# Altium project System Control.PrjPCB (part 2 of 3)

## Sheet System Control - FPGA Supply and Configuration.SchDoc
size C
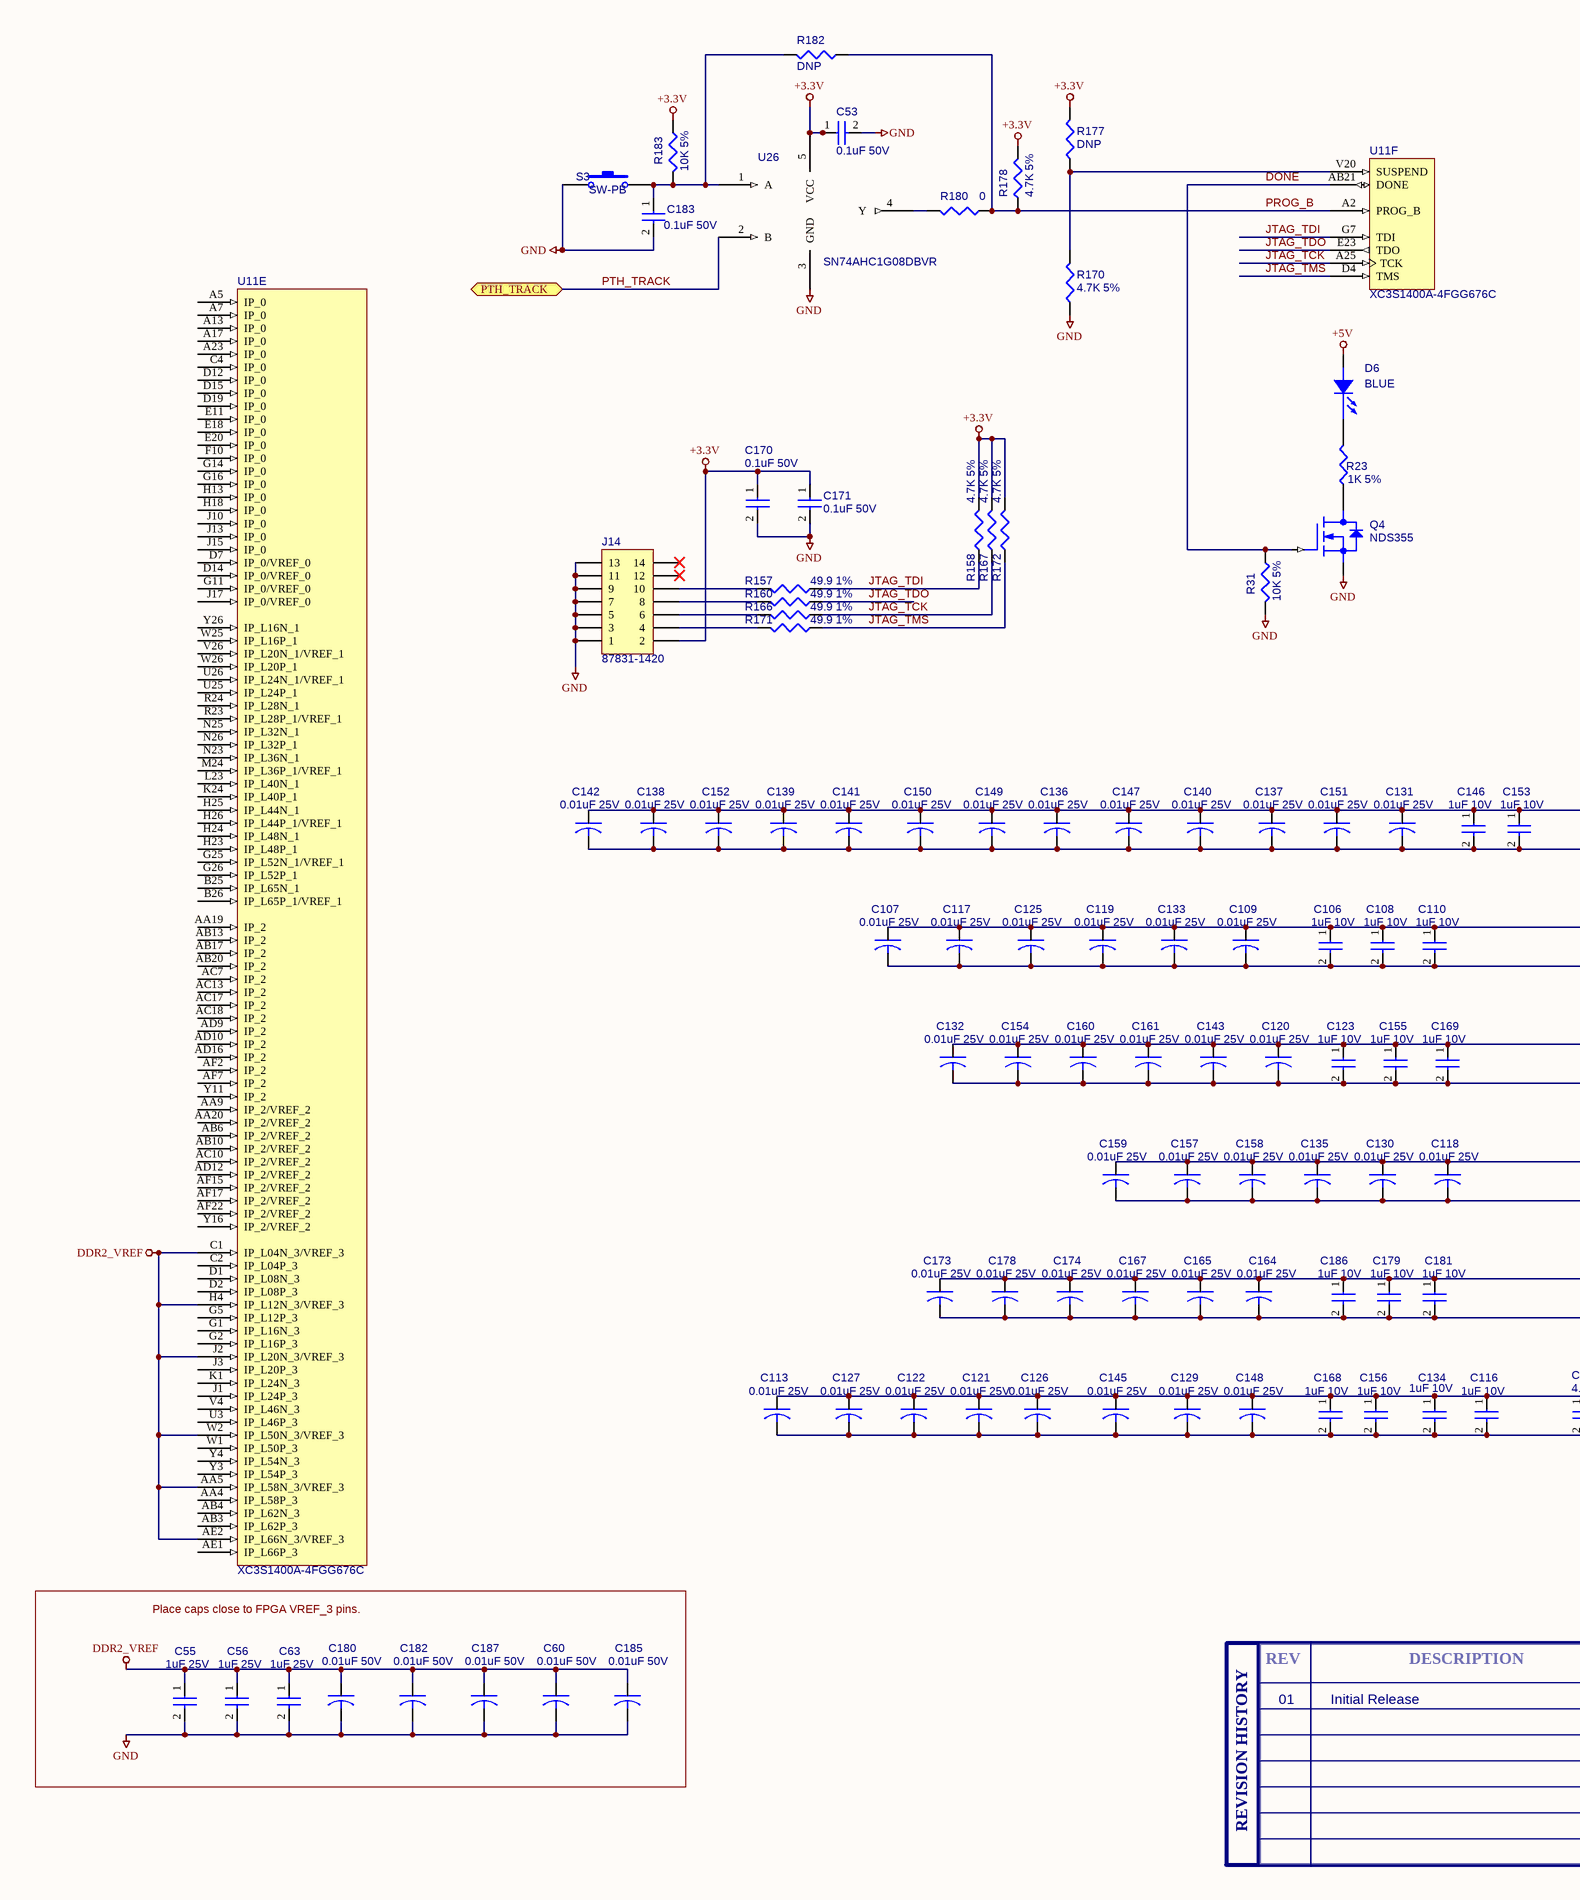
[diagram p4: System Control - FPGA Supply and Configuration.SchDoc, left]
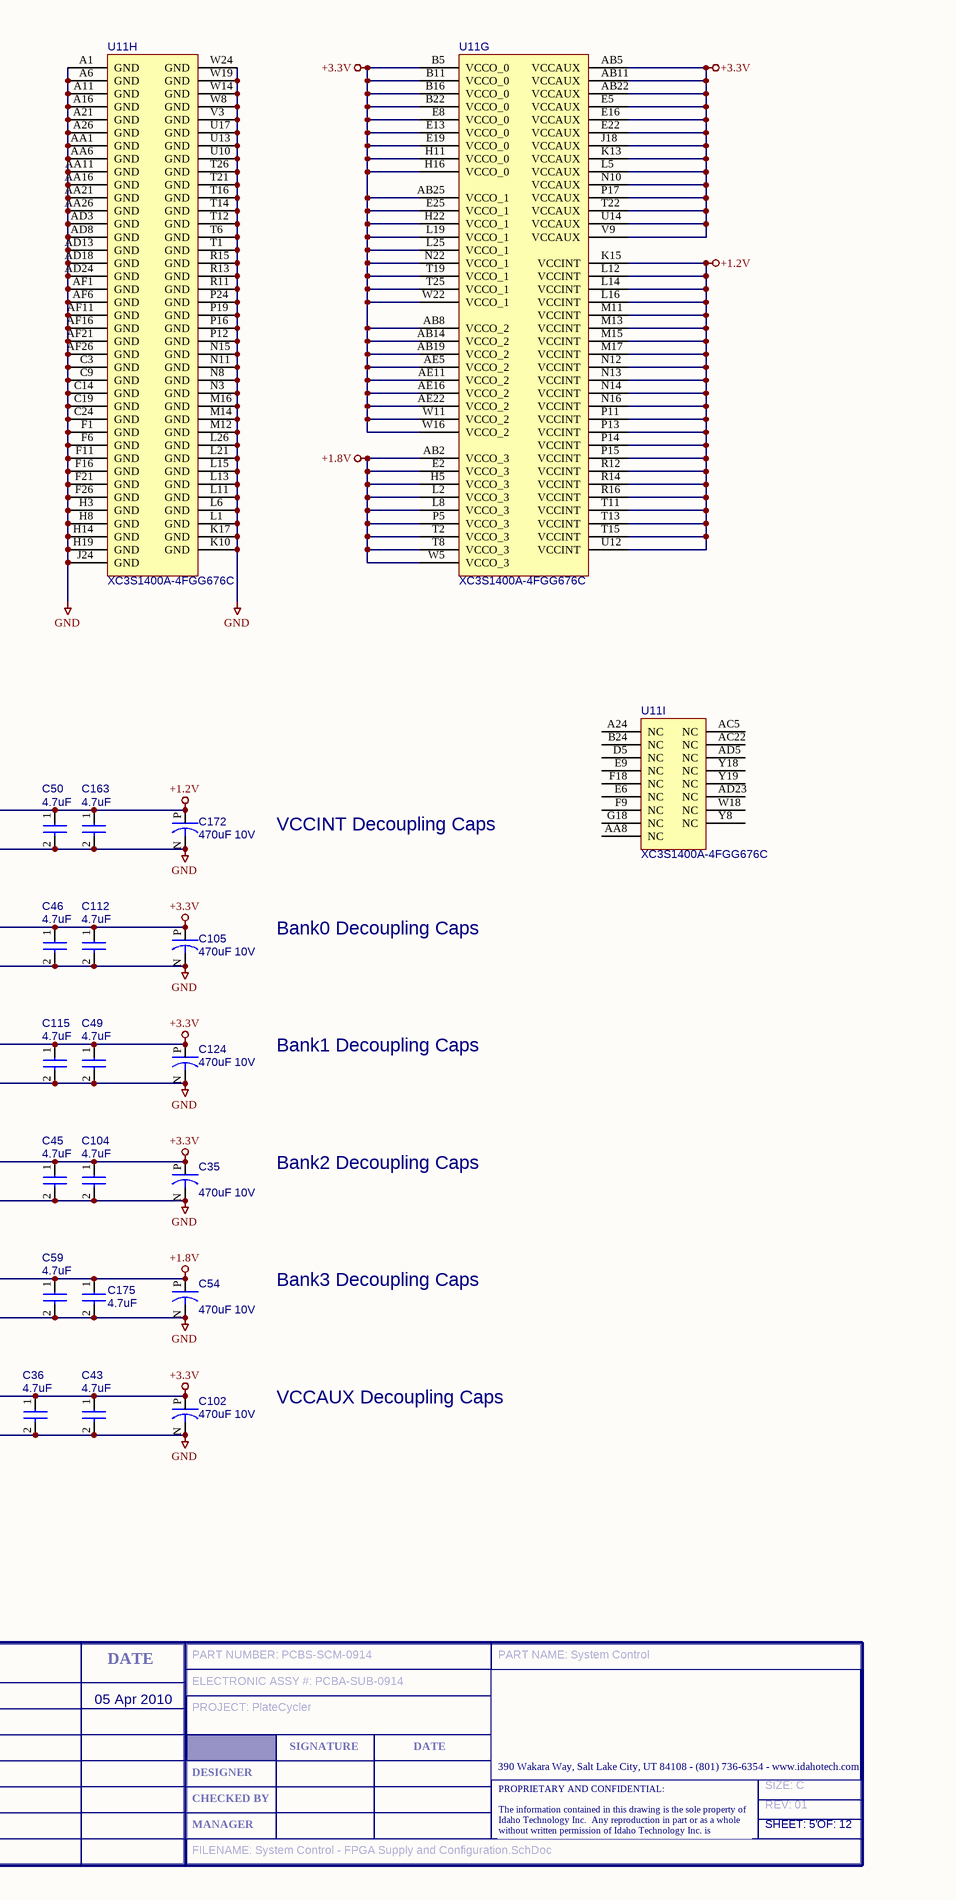
[diagram p5: System Control - FPGA Supply and Configuration.SchDoc, right]

### Parts
(Parts that share a designator on the sheet are numbered #1, #2 ... from top to bottom, then left to right.)
C35  470uF 10V  [SM/CT_7360]
C36  4.7uF  [SM/C_0603]
C43  4.7uF  [SM/C_0603]
C45  4.7uF  [SM/C_0603]
C46  4.7uF  [SM/C_0603]
C49  4.7uF  [SM/C_0603]
C50  4.7uF  [SM/C_0603]
C53  0.1uF 50V  [SM/C_0603]
C54  470uF 10V  [SM/CT_7360]
C55  1uF 25V  [SM/C_0603]
C56  1uF 25V  [SM/C_0603]
C59  4.7uF  [SM/C_0603]
C60  0.01uF 50V  [SM/C_0603]
C63  1uF 25V  [SM/C_0603]
C102  470uF 10V  [SM/CT_7360]
C104  4.7uF  [SM/C_0603]
C105  470uF 10V  [SM/CT_7360]
C106  1uF 10V  [SM/C_0603]
C107  0.01uF 25V  [SM/C_0402]
C108  1uF 10V  [SM/C_0603]
C109  0.01uF 25V  [SM/C_0402]
C110  1uF 10V  [SM/C_0603]
C112  4.7uF  [SM/C_0603]
C113  0.01uF 25V  [SM/C_0402]
C115  4.7uF  [SM/C_0603]
C116  1uF 10V  [SM/C_0603]
C117  0.01uF 25V  [SM/C_0402]
C118  0.01uF 25V  [SM/C_0402]
C119  0.01uF 25V  [SM/C_0402]
C120  0.01uF 25V  [SM/C_0402]
C121  0.01uF 25V  [SM/C_0402]
C122  0.01uF 25V  [SM/C_0402]
C123  1uF 10V  [SM/C_0603]
C124  470uF 10V  [SM/CT_7360]
C125  0.01uF 25V  [SM/C_0402]
C126  0.01uF 25V  [SM/C_0402]
C127  0.01uF 25V  [SM/C_0402]
C129  0.01uF 25V  [SM/C_0402]
C130  0.01uF 25V  [SM/C_0402]
C131  0.01uF 25V  [SM/C_0402]
C132  0.01uF 25V  [SM/C_0402]
C133  0.01uF 25V  [SM/C_0402]
C134  1uF 10V  [SM/C_0603]
C135  0.01uF 25V  [SM/C_0402]
C136  0.01uF 25V  [SM/C_0402]
C137  0.01uF 25V  [SM/C_0402]
C138  0.01uF 25V  [SM/C_0402]
C139  0.01uF 25V  [SM/C_0402]
C140  0.01uF 25V  [SM/C_0402]
C141  0.01uF 25V  [SM/C_0402]
C142  0.01uF 25V  [SM/C_0402]
C143  0.01uF 25V  [SM/C_0402]
C145  0.01uF 25V  [SM/C_0402]
C146  1uF 10V  [SM/C_0603]
C147  0.01uF 25V  [SM/C_0402]
C148  0.01uF 25V  [SM/C_0402]
C149  0.01uF 25V  [SM/C_0402]
C150  0.01uF 25V  [SM/C_0402]
C151  0.01uF 25V  [SM/C_0402]
C152  0.01uF 25V  [SM/C_0402]
C153  1uF 10V  [SM/C_0603]
C154  0.01uF 25V  [SM/C_0402]
C155  1uF 10V  [SM/C_0603]
C156  1uF 10V  [SM/C_0603]
C157  0.01uF 25V  [SM/C_0402]
C158  0.01uF 25V  [SM/C_0402]
C159  0.01uF 25V  [SM/C_0402]
C160  0.01uF 25V  [SM/C_0402]
C161  0.01uF 25V  [SM/C_0402]
C163  4.7uF  [SM/C_0603]
C164  0.01uF 25V  [SM/C_0402]
C165  0.01uF 25V  [SM/C_0402]
C167  0.01uF 25V  [SM/C_0402]
C168  1uF 10V  [SM/C_0603]
C169  1uF 10V  [SM/C_0603]
C170  0.1uF 50V  [SM/C_0603]
C171  0.1uF 50V  [SM/C_0603]
C172  470uF 10V  [SM/CT_7360]
C173  0.01uF 25V  [SM/C_0402]
C174  0.01uF 25V  [SM/C_0402]
C175  4.7uF  [SM/C_0603]
C178  0.01uF 25V  [SM/C_0402]
C179  1uF 10V  [SM/C_0603]
C180  0.01uF 50V  [SM/C_0603]
C181  1uF 10V  [SM/C_0603]
C182  0.01uF 50V  [SM/C_0603]
C183  0.1uF 50V  [SM/C_0603]
C185  0.01uF 50V  [SM/C_0603]
C186  1uF 10V  [SM/C_0603]
C187  0.01uF 50V  [SM/C_0603]
D6  BLUE  [LED 1206]
J14  Header 7X2  [87831-1420]  (value not drawn)
Q4  NDS355  [TO236AA/SOT23]
R23  1K 5%  [SM/R_0603]
R31  10K 5%  [SM/R_0603]
R157  49.9 1%  [SM/R_0603]
R158  4.7K 5%  [SM/R_0603]
R160  49.9 1%  [SM/R_0603]
R166  49.9 1%  [SM/R_0603]
R167  4.7K 5%  [SM/R_0603]
R170  4.7K 5%  [SM/R_0603]
R171  49.9 1%  [SM/R_0603]
R172  4.7K 5%  [SM/R_0603]
R177  DNP  [SM/R_0603]  (no BOM)
R178  4.7K 5%  [SM/R_0603]
R180  0  [SM/R_0603]
R182  DNP  [SM/R_0603]  (no BOM)
R183  10K 5%  [SM/R_0603]
S3  SW-PB  [PBSW SMD]
T?#5  SIZE: C  REV: 01  FILENAME: System Control - FPGA Supply and Configuration.SchDoc  PART NUMBER: PCBS-SCM-0914  PART NAME: System Control  ELECTRONIC ASSY #: PCBA-SUB-0914  PROJECT: PlateCycler  SHEET: 5'  OF: 12  (hidden comment: ITI Title Block, A Size)  (graphical)
U11  XC3S1400A-4FGG676C  [FGG676]  (parts E,F,G,H,I of 9)
U26  Manufacturer P/N: SN74AHC1G08DBVR  [SOT23-5]  (hidden comment: SN74AHC1G08)

### Blocks framed on the sheet
Place caps close to FPGA VREF_3 pins.: C55 C56 C60 C63 C180 C182 C185 C187

### Ports
PTH_TRACK

### Nets
+1.2V: C50.1 C131.1 C136.1 C137.1 C138.1 C139.1 C140.1 C141.1 C142.1 C146.1 C147.1 C149.1 C150.1 C151.1 C152.1 C153.1 C163.1 C172.P U11.K15(VCCINT) U11.L12(VCCINT) U11.L14(VCCINT) U11.L16(VCCINT) U11.M11(VCCINT) U11.M13(VCCINT) U11.M15(VCCINT) U11.M17(VCCINT) U11.N12(VCCINT) U11.N13(VCCINT) U11.N14(VCCINT) U11.N16(VCCINT) U11.P11(VCCINT) U11.P13(VCCINT) U11.P14(VCCINT) U11.P15(VCCINT) U11.R12(VCCINT) U11.R14(VCCINT) U11.R16(VCCINT) U11.T11(VCCINT) U11.T13(VCCINT) U11.T15(VCCINT) U11.U12(VCCINT)
+1.8V: C54.P C59.1 C164.1 C165.1 C167.1 C173.1 C174.1 C175.1 C178.1 C179.1 C181.1 C186.1 U11.AB2(VCCO_3) U11.E2(VCCO_3) U11.H5(VCCO_3) U11.L2(VCCO_3) U11.L8(VCCO_3) U11.P5(VCCO_3) U11.T2(VCCO_3) U11.T8(VCCO_3) U11.W5(VCCO_3)
+3.3V: C35.P C36.1 C43.1 C45.1 C46.1 C49.1 C53.1 C102.P C104.1 C105.P C106.1 C107.1 C108.1 C109.1 C110.1 C112.1 C113.1 C115.1 C116.1 C117.1 C118.1 C119.1 C120.1 C121.1 C122.1 C123.1 C124.P C125.1 C126.1 C127.1 C129.1 C130.1 C132.1 C133.1 C134.1 C135.1 C143.1 C145.1 C148.1 C154.1 C155.1 C156.1 C157.1 C158.1 C159.1 C160.1 C161.1 C168.1 C169.1 C170.1 C171.1 J14.2 R158.2 R167.2 R172.2 R177.2 R178.2 R183.1 U11.AB5(VCCAUX) U11.AB8(VCCO_2) U11.AB11(VCCAUX) U11.AB14(VCCO_2) U11.AB19(VCCO_2) U11.AB22(VCCAUX) U11.AB25(VCCO_1) U11.AE5(VCCO_2) U11.AE11(VCCO_2) U11.AE16(VCCO_2) U11.AE22(VCCO_2) U11.B5(VCCO_0) U11.B11(VCCO_0) U11.B16(VCCO_0) U11.B22(VCCO_0) U11.E5(VCCAUX) U11.E8(VCCO_0) U11.E13(VCCO_0) U11.E16(VCCAUX) U11.E19(VCCO_0) U11.E22(VCCAUX) U11.E25(VCCO_1) U11.H11(VCCO_0) U11.H16(VCCO_0) U11.H22(VCCO_1) U11.J18(VCCAUX) U11.K13(VCCAUX) U11.L5(VCCAUX) U11.L19(VCCO_1) U11.L25(VCCO_1) U11.N10(VCCAUX) U11.N22(VCCO_1) U11.P17(VCCAUX) U11.T19(VCCO_1) U11.T22(VCCAUX) U11.T25(VCCO_1) U11.U14(VCCAUX) U11.V9(VCCAUX) U11.W11(VCCO_2) U11.W16(VCCO_2) U11.W22(VCCO_1) U26.5(VCC)
+5V: D6.1(ANODE)
DDR2_VREF: C55.1 C56.1 C60.1 C63.1 C180.1 C182.1 C185.1 C187.1 U11.AA5(IP_L58N_3/VREF_3) U11.AE2(IP_L66N_3/VREF_3) U11.C1(IP_L04N_3/VREF_3) U11.H4(IP_L12N_3/VREF_3) U11.J2(IP_L20N_3/VREF_3) U11.W2(IP_L50N_3/VREF_3)
GND: C35.N C36.2 C43.2 C45.2 C46.2 C49.2 C50.2 C53.2 C54.N C55.2 C56.2 C59.2 C60.2 C63.2 C102.N C104.2 C105.N C106.2 C107.2 C108.2 C109.2 C110.2 C112.2 C113.2 C115.2 C116.2 C117.2 C118.2 C119.2 C120.2 C121.2 C122.2 C123.2 C124.N C125.2 C126.2 C127.2 C129.2 C130.2 C131.2 C132.2 C133.2 C134.2 C135.2 C136.2 C137.2 C138.2 C139.2 C140.2 C141.2 C142.2 C143.2 C145.2 C146.2 C147.2 C148.2 C149.2 C150.2 C151.2 C152.2 C153.2 C154.2 C155.2 C156.2 C157.2 C158.2 C159.2 C160.2 C161.2 C163.2 C164.2 C165.2 C167.2 C168.2 C169.2 C170.2 C171.2 C172.N C173.2 C174.2 C175.2 C178.2 C179.2 C180.2 C181.2 C182.2 C183.2 C185.2 C186.2 C187.2 J14.1 J14.3 J14.5 J14.7 J14.9 J14.11 J14.13 Q4.2(SOURCE) R31.2 R170.1 S3.1 U11.A1(GND) U11.A6(GND) U11.A11(GND) U11.A16(GND) U11.A21(GND) U11.A26(GND) U11.AA1(GND) U11.AA6(GND) U11.AA11(GND) U11.AA16(GND) U11.AA21(GND) U11.AA26(GND) U11.AD3(GND) U11.AD8(GND) U11.AD13(GND) U11.AD18(GND) U11.AD24(GND) U11.AF1(GND) U11.AF6(GND) U11.AF11(GND) U11.AF16(GND) U11.AF21(GND) U11.AF26(GND) U11.C3(GND) U11.C9(GND) U11.C14(GND) U11.C19(GND) U11.C24(GND) U11.F1(GND) U11.F6(GND) U11.F11(GND) U11.F16(GND) U11.F21(GND) U11.F26(GND) U11.H3(GND) U11.H8(GND) U11.H14(GND) U11.H19(GND) U11.J24(GND) U11.K10(GND) U11.K17(GND) U11.L1(GND) U11.L6(GND) U11.L11(GND) U11.L13(GND) U11.L15(GND) U11.L21(GND) U11.L26(GND) U11.M12(GND) U11.M14(GND) U11.M16(GND) U11.N3(GND) U11.N8(GND) U11.N11(GND) U11.N15(GND) U11.P12(GND) U11.P16(GND) U11.P19(GND) U11.P24(GND) U11.R11(GND) U11.R13(GND) U11.R15(GND) U11.T1(GND) U11.T6(GND) U11.T12(GND) U11.T14(GND) U11.T16(GND) U11.T21(GND) U11.T26(GND) U11.U10(GND) U11.U13(GND) U11.U17(GND) U11.V3(GND) U11.W8(GND) U11.W14(GND) U11.W19(GND) U11.W24(GND) U26.3(GND)
DONE: Q4.1(GATE) R31.1 U11.AB21(DONE)
JTAG_TCK: R166.1 R167.1 U11.A25(TCK)
JTAG_TDI: R157.1 R158.1 U11.G7(TDI)
JTAG_TDO: R160.1 U11.E23(TDO)
JTAG_TMS: R171.1 R172.1 U11.D4(TMS)
PROG_B: R178.1 R180.1 R182.1 U11.A2(PROG_B)
PTH_TRACK: U26.2(B) ; port PTH_TRACK
NetC183_1: C183.1 R182.2 R183.2 S3.2 U26.1(A)
NetD6_2: D6.2(CATHODE) R23.2
NetJ14_4: J14.4 R171.2
NetJ14_6: J14.6 R166.2
NetJ14_8: J14.8 R160.2
NetJ14_10: J14.10 R157.2
NetQ4_3: Q4.3(DRAIN) R23.1
NetR170_2: R170.2 R177.1 U11.V20(SUSPEND)
NetR180_2: R180.2 U26.4(Y)

Not connected (* = marked no-connect by the designer): J14 12* 14*; U11 A5(IP_0) A7(IP_0) A13(IP_0) A17(IP_0) A23(IP_0) A24(NC) AA4(IP_L58P_3) AA8(NC) AA9(IP_2/VREF_2) AA19(IP_2) AA20(IP_2/VREF_2) AB3(IP_L62P_3) AB4(IP_L62N_3) AB6(IP_2/VREF_2) AB10(IP_2/VREF_2) AB13(IP_2) AB17(IP_2) AB20(IP_2) AC5(NC) AC7(IP_2) AC10(IP_2/VREF_2) AC13(IP_2) AC17(IP_2) AC18(IP_2) AC22(NC) AD5(NC) AD9(IP_2) AD10(IP_2) AD12(IP_2/VREF_2) AD16(IP_2) AD23(NC) AE1(IP_L66P_3) AF2(IP_2) AF7(IP_2) AF15(IP_2/VREF_2) AF17(IP_2/VREF_2) AF22(IP_2/VREF_2) B24(NC) B25(IP_L65N_1) B26(IP_L65P_1/VREF_1) C2(IP_L04P_3) C4(IP_0) D1(IP_L08N_3) D2(IP_L08P_3) D5(NC) D7(IP_0/VREF_0) D12(IP_0) D14(IP_0/VREF_0) D15(IP_0) D19(IP_0) E6(NC) E9(NC) E11(IP_0) E18(IP_0) E20(IP_0) F9(NC) F10(IP_0) F18(NC) G1(IP_L16N_3) G2(IP_L16P_3) G5(IP_L12P_3) G11(IP_0/VREF_0) G14(IP_0) G16(IP_0) G18(NC) G25(IP_L52N_1/VREF_1) G26(IP_L52P_1) H13(IP_0) H18(IP_0) H23(IP_L48P_1) H24(IP_L48N_1) H25(IP_L44N_1) H26(IP_L44P_1/VREF_1) J1(IP_L24P_3) J3(IP_L20P_3) J10(IP_0) J13(IP_0) J15(IP_0) J17(IP_0/VREF_0) K1(IP_L24N_3) K24(IP_L40P_1) L23(IP_L40N_1) M24(IP_L36P_1/VREF_1) N23(IP_L36N_1) N25(IP_L32N_1) N26(IP_L32P_1) R23(IP_L28P_1/VREF_1) R24(IP_L28N_1) U3(IP_L46P_3) U25(IP_L24P_1) U26(IP_L24N_1/VREF_1) V4(IP_L46N_3) V26(IP_L20N_1/VREF_1) W1(IP_L50P_3) W18(NC) W25(IP_L16P_1) W26(IP_L20P_1) Y3(IP_L54P_3) Y4(IP_L54N_3) Y8(NC) Y11(IP_2) Y16(IP_2/VREF_2) Y18(NC) Y19(NC) Y26(IP_L16N_1)

### Notes on the sheet
- VCCINT Decoupling Caps
- Bank0 Decoupling Caps
- Bank1 Decoupling Caps
- Bank2 Decoupling Caps
- Bank3 Decoupling Caps
- VCCAUX Decoupling Caps
- 01
- Initial Release
- 05 Apr 2010
- (in symbol ITI A-size Title Block and Rev Table) REV; DESCRIPTION; DATE; SIGNATURE; 390 Wakara Way, Salt Lake City, UT 84108 - (801) 736-6354 - www.idahotech.com; DESIGNER; CHECKED BY; REVISION HISTORY; MANAGER; PROPRIETARY AND CONFIDENTIAL: / The information contained in this drawing is the sole property of / Idaho Technology Inc.  Any reproduction in part or as a whole / without written permission of Idaho Technology Inc. is prohibited.

### Library data of the parts
C35 C54 C102 C105 C124 C172 = CAP_1: CAP TANT LOESR 470UF 10V 10% SMD; Manufacturer: AVX Corporation; Manufacturer P/N: TPSV477K010R0060; Vendor: Digikey; Vendor P/N: 478-4162-1-ND
C36 C43 C45 C46 C49 C50 C59 C104 C112 C115 C163 C175 = CAP NP_1: CAP CER 4.7UF 10V Y5V 0603; Manufacturer P/N: GRM188F51A475ZE20D; Manufacturer: Murata; Vendor P/N: 490-3302-1-ND; Vendor: Digikey
C53 C170 C171 C183 = CAP NP_1: as C47 on sheet System Control - Bank0
C55 C56 C63 = CAP NP_1: CAP 1UF 25V CERAMIC 0603 X5S; Manufacturer P/N: ECJ-1V41E105M; Manufacturer: Panasonic; Vendor P/N: PCC2354CT-ND; Vendor: Digikey
C60 C180 C182 C185 C187 = C10nF 50V X7R 0603: CAP 10000PF 50V CERM X7R 0603; Manufacturer: Panasonic; Manufacturer P/N: ECJ-1VB1H103K; Vendor P/N: PCC1784CT-ND; Vendor: Digikey
C106 C108 C110 C116 C123 C134 C146 C153 C155 C156 C168 C169 C179 C181 C186 = CAP NP_1: CAP CER 1.0UF 10V X5R 10% 0402; Manufacturer P/N: 0402ZD105KAT2A; Manufacturer: AVX Corporation; Vendor P/N: 478-4596-1-ND; Vendor: Digikey
C107 C109 C113 C117-C122 C125-C127 C129-C133 C135-C143 C145 C147-C152 C154 C157-C161 C164 C165 C167 C173 C174 C178 = C10nF 50V X7R 0603: CAP .01UF 25V CERAMIC X7R 0402; Manufacturer: Panasonic; Manufacturer P/N: ECJ-0EB1E103K; Vendor P/N: PCC2270CT-ND; Vendor: Digikey
D6 = LED: LED INGAN/SIC U-BLUE CLR 1206SMD; Manufacturer: Lumex; Manufacturer P/N: SML-LX1206USBC-TR; Vendor: Digikey; Vendor P/N: 67-1701-1-ND
J14 = Header 7X2: CONN HEADER 14POS 2MM VERT GOLD; Manufacturer: Molex; Vendor P/N: WM17469-ND; Vendor: Digikey; LatestRevisionDate: 17-Jul-2002; LatestRevisionNote: Re-released for DXP Platform.; Publisher: Altium Limited; Manufacturer P/N: 87831-1420
Q4 = NDS355N/SOT: as Q5 on sheet System Control - Bank0; Manufacturer P/N: NDS355N
R23 = R1K 5% 0603: as R38 on sheet System Control - Bank0
R31 R183 = R10K 5% 0603: as R37 on sheet System Control - Bank0
R157 R160 R166 R171 = R1K 5% 0603: RES 49.9 OHM 1/10W 1% 0603 SMD; Manufacturer: Panasonic; Manufacturer P/N: ERJ-3EKF49R9V; Vendor: Digikey; Vendor P/N: P49.9HCT-ND
R158 R167 R170 R172 R177 R178 = R4.7K 5% 0603: RES 4.7K OHM 1/10W 5% 0603 SMD; Manufacturer P/N: ERJ-3GEYJ472V; Manufacturer: Panasonic; Vendor: Digikey; Vendor P/N: P4.7KGCT-ND
R180 R182 = R0 5% 0603: RES ZERO OHM 1/10W 5% 0603 SMD; Manufacturer: Panasonic; Manufacturer P/N: ERJ-3GEY0R00V; Vendor: Digikey; Vendor P/N: P0.0GCT-ND
S3 = SW-PB: SWITCH KEY 4MM SQ SMD GULL WING; Manufacturer: Bourns; Manufacturer P/N: 7914G-1-000E; Vendor P/N: 7914G-000ECT-ND; Vendor: Digikey
T?#5 = ITI A-size Title Block and Rev Table: ITI Title Block and Rev Table, A Size
U11 = XC3S1400A-4FGG676C: Spartan-3A  I/O Optimized FPGA, 502 User I/Os, 676-Pin Pb-Free FBGA, Standard Performance, Commercial Grade; Published: 12-Dec-2006; DatasheetVersion: 08-May-2007; PackageVersion: ver1.2.1, Apr-2005; PackageReference: FGG676; Publisher: Altium Limited; PackageDescription: 676-Ball Fine Pitch Ball Grid Array (FGG676) - Pb-Free; Code_JEDEC: MS-034-AAL-1; Code_IPC: BGA100P26X26-676; ComponentLink1Description: Manufacturer Link; ComponentLink1URL: http://www.xilinx.com/products/silicon_solutions/fpgas/spartan_series/spartan3a_fpgas/index.htm; ComponentLink2Description: Datasheet; ComponentLink2URL: http://direct.xilinx.com/bvdocs/publications/ds529.pdf
U26 = SN74AHC1G08: IC SGL 2IN POS-AND GATE SOT23-5; Manufacturer: Texas Instruments; Vendor P/N: 296-1091-1-ND; Vendor: Digikey; LatestRevisionDate: 17-Jul-2002; LatestRevisionNote: Re-released for DXP Platform.; Publisher: Altium Limited

## Sheet System Control - Mode DIP Switch.SchDoc
size B
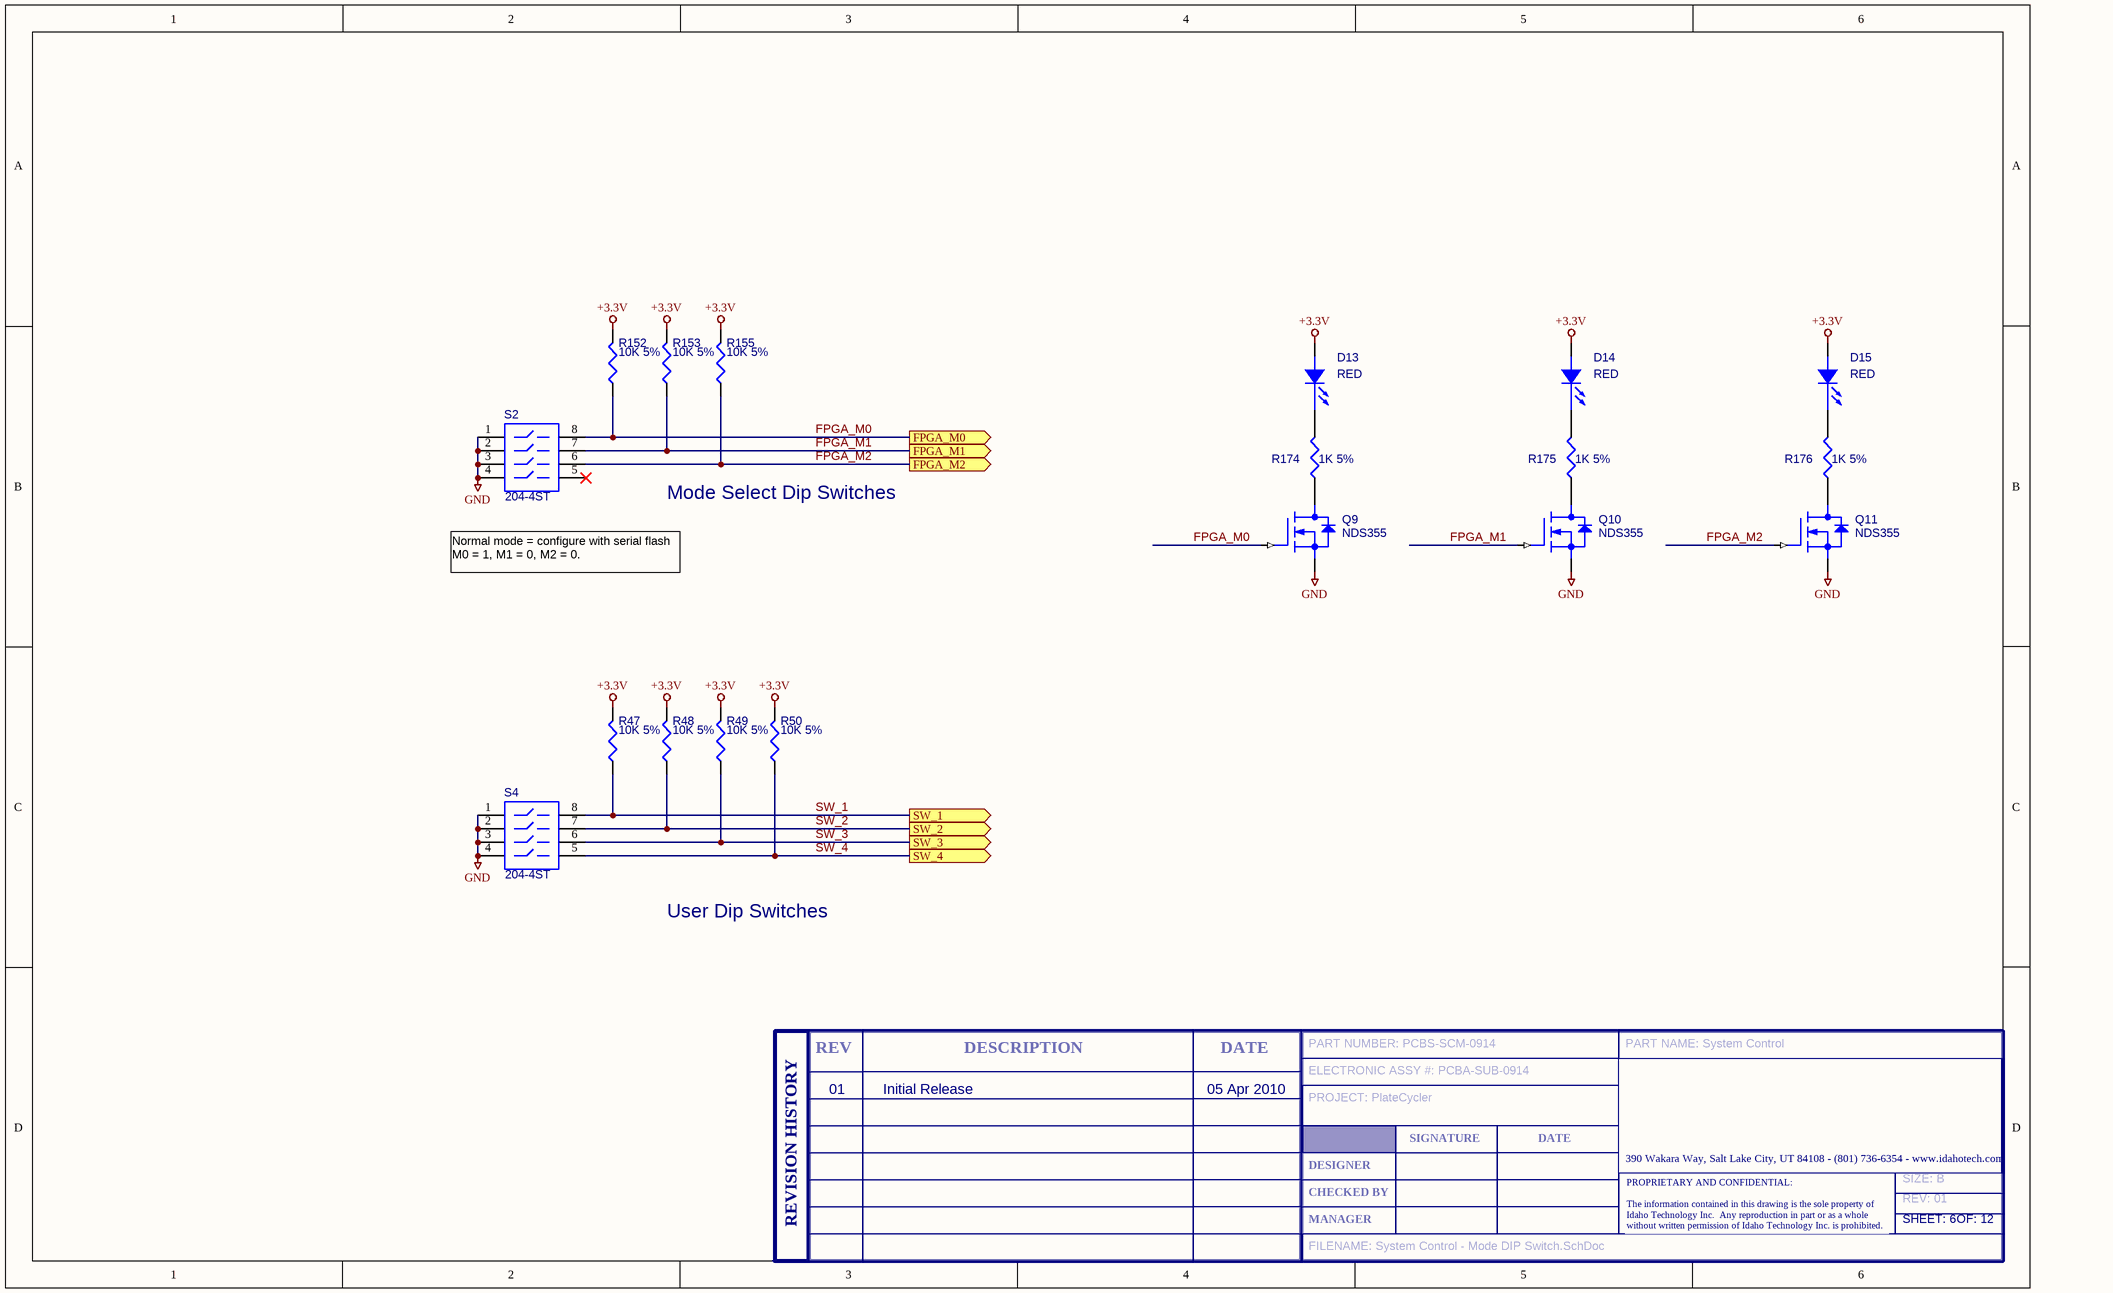
[diagram p6: System Control - Mode DIP Switch.SchDoc]

### Parts
(Parts that share a designator on the sheet are numbered #1, #2 ... from top to bottom, then left to right.)
D13  RED  [LED 1206]
D14  RED  [LED 1206]
D15  RED  [LED 1206]
Q9  NDS355  [TO236AA/SOT23]
Q10  NDS355  [TO236AA/SOT23]
Q11  NDS355  [TO236AA/SOT23]
R47  10K 5%  [SM/R_0603]
R48  10K 5%  [SM/R_0603]
R49  10K 5%  [SM/R_0603]
R50  10K 5%  [SM/R_0603]
R152  10K 5%  [SM/R_0603]
R153  10K 5%  [SM/R_0603]
R155  10K 5%  [SM/R_0603]
R174  1K 5%  [SM/R_0603]
R175  1K 5%  [SM/R_0603]
R176  1K 5%  [SM/R_0603]
S2  Manufacturer P/N: 204-4ST  [SPST_SMT8]  (hidden comment: SW-DIP4)
S4  Manufacturer P/N: 204-4ST  [SPST_SMT8]  (hidden comment: SW-DIP4)
T?#6  SIZE: B  REV: 01  FILENAME: System Control - Mode DIP Switch.SchDoc  PART NUMBER: PCBS-SCM-0914  PART NAME: System Control  ELECTRONIC ASSY #: PCBA-SUB-0914  PROJECT: PlateCycler  SHEET: 6  OF: 12  (hidden comment: ITI Title Block, A Size)  (graphical)

### Ports
FPGA_M0 (out), FPGA_M1 (out), FPGA_M2 (out), SW_1 (out), SW_2 (out), SW_3 (out), SW_4 (out)

### Nets
+3.3V: D13.1(ANODE) D14.1(ANODE) D15.1(ANODE) R47.2 R48.2 R49.2 R50.2 R152.2 R153.2 R155.2
GND: Q9.2(SOURCE) Q10.2(SOURCE) Q11.2(SOURCE) S2.1 S2.2 S2.3 S2.4 S4.1 S4.2 S4.3 S4.4
FPGA_M0: Q9.1(GATE) R152.1 S2.8 ; port FPGA_M0
FPGA_M1: Q10.1(GATE) R153.1 S2.7 ; port FPGA_M1
FPGA_M2: Q11.1(GATE) R155.1 S2.6 ; port FPGA_M2
SW_1: R47.1 S4.8 ; port SW_1
SW_2: R48.1 S4.7 ; port SW_2
SW_3: R49.1 S4.6 ; port SW_3
SW_4: R50.1 S4.5 ; port SW_4
NetD13_2: D13.2(CATHODE) R174.2
NetD14_2: D14.2(CATHODE) R175.2
NetD15_2: D15.2(CATHODE) R176.2
NetQ9_3: Q9.3(DRAIN) R174.1
NetQ10_3: Q10.3(DRAIN) R175.1
NetQ11_3: Q11.3(DRAIN) R176.1

Not connected (* = marked no-connect by the designer): S2 5*

### Notes on the sheet
- Mode Select Dip Switches
- Normal mode = configure with serial flash
  M0 = 1, M1 = 0, M2 = 0.
- User Dip Switches
- 01
- Initial Release
- 05 Apr 2010
- (in symbol ITI A-size Title Block and Rev Table) REV; DESCRIPTION; DATE; SIGNATURE; 390 Wakara Way, Salt Lake City, UT 84108 - (801) 736-6354 - www.idahotech.com; DESIGNER; CHECKED BY; REVISION HISTORY; MANAGER; PROPRIETARY AND CONFIDENTIAL: / The information contained in this drawing is the sole property of / Idaho Technology Inc.  Any reproduction in part or as a whole / without written permission of Idaho Technology Inc. is prohibited.

### Library data of the parts
D13-D15 = LED: as D9 on sheet System Control - Bank0
Q9-Q11 = NDS355N/SOT: as Q5 on sheet System Control - Bank0; Manufacturer P/N: NDS355N
R47-R50 R152 R153 R155 = R10K 5% 0603: as R37 on sheet System Control - Bank0
R174-R176 = R1K 5% 0603: as R38 on sheet System Control - Bank0
S2 S4 = SW-DIP4: SWITCH DIP 4POS TOP SLIDE SMT; Manufacturer: CTS Corporation Electro Components; Vendor: Digikey; Vendor P/N: CT2044ST-ND; Published: 24-Mar-1999; LatestRevisionDate: 17-Jul-2002; LatestRevisionNote: Re-released for DXP Platform.; PackageReference: DIP-8; Publisher: Altium Limited
T?#6 = ITI A-size Title Block and Rev Table: ITI Title Block and Rev Table, A Size

## Sheet System Control - Parallel Flash.SchDoc
size B
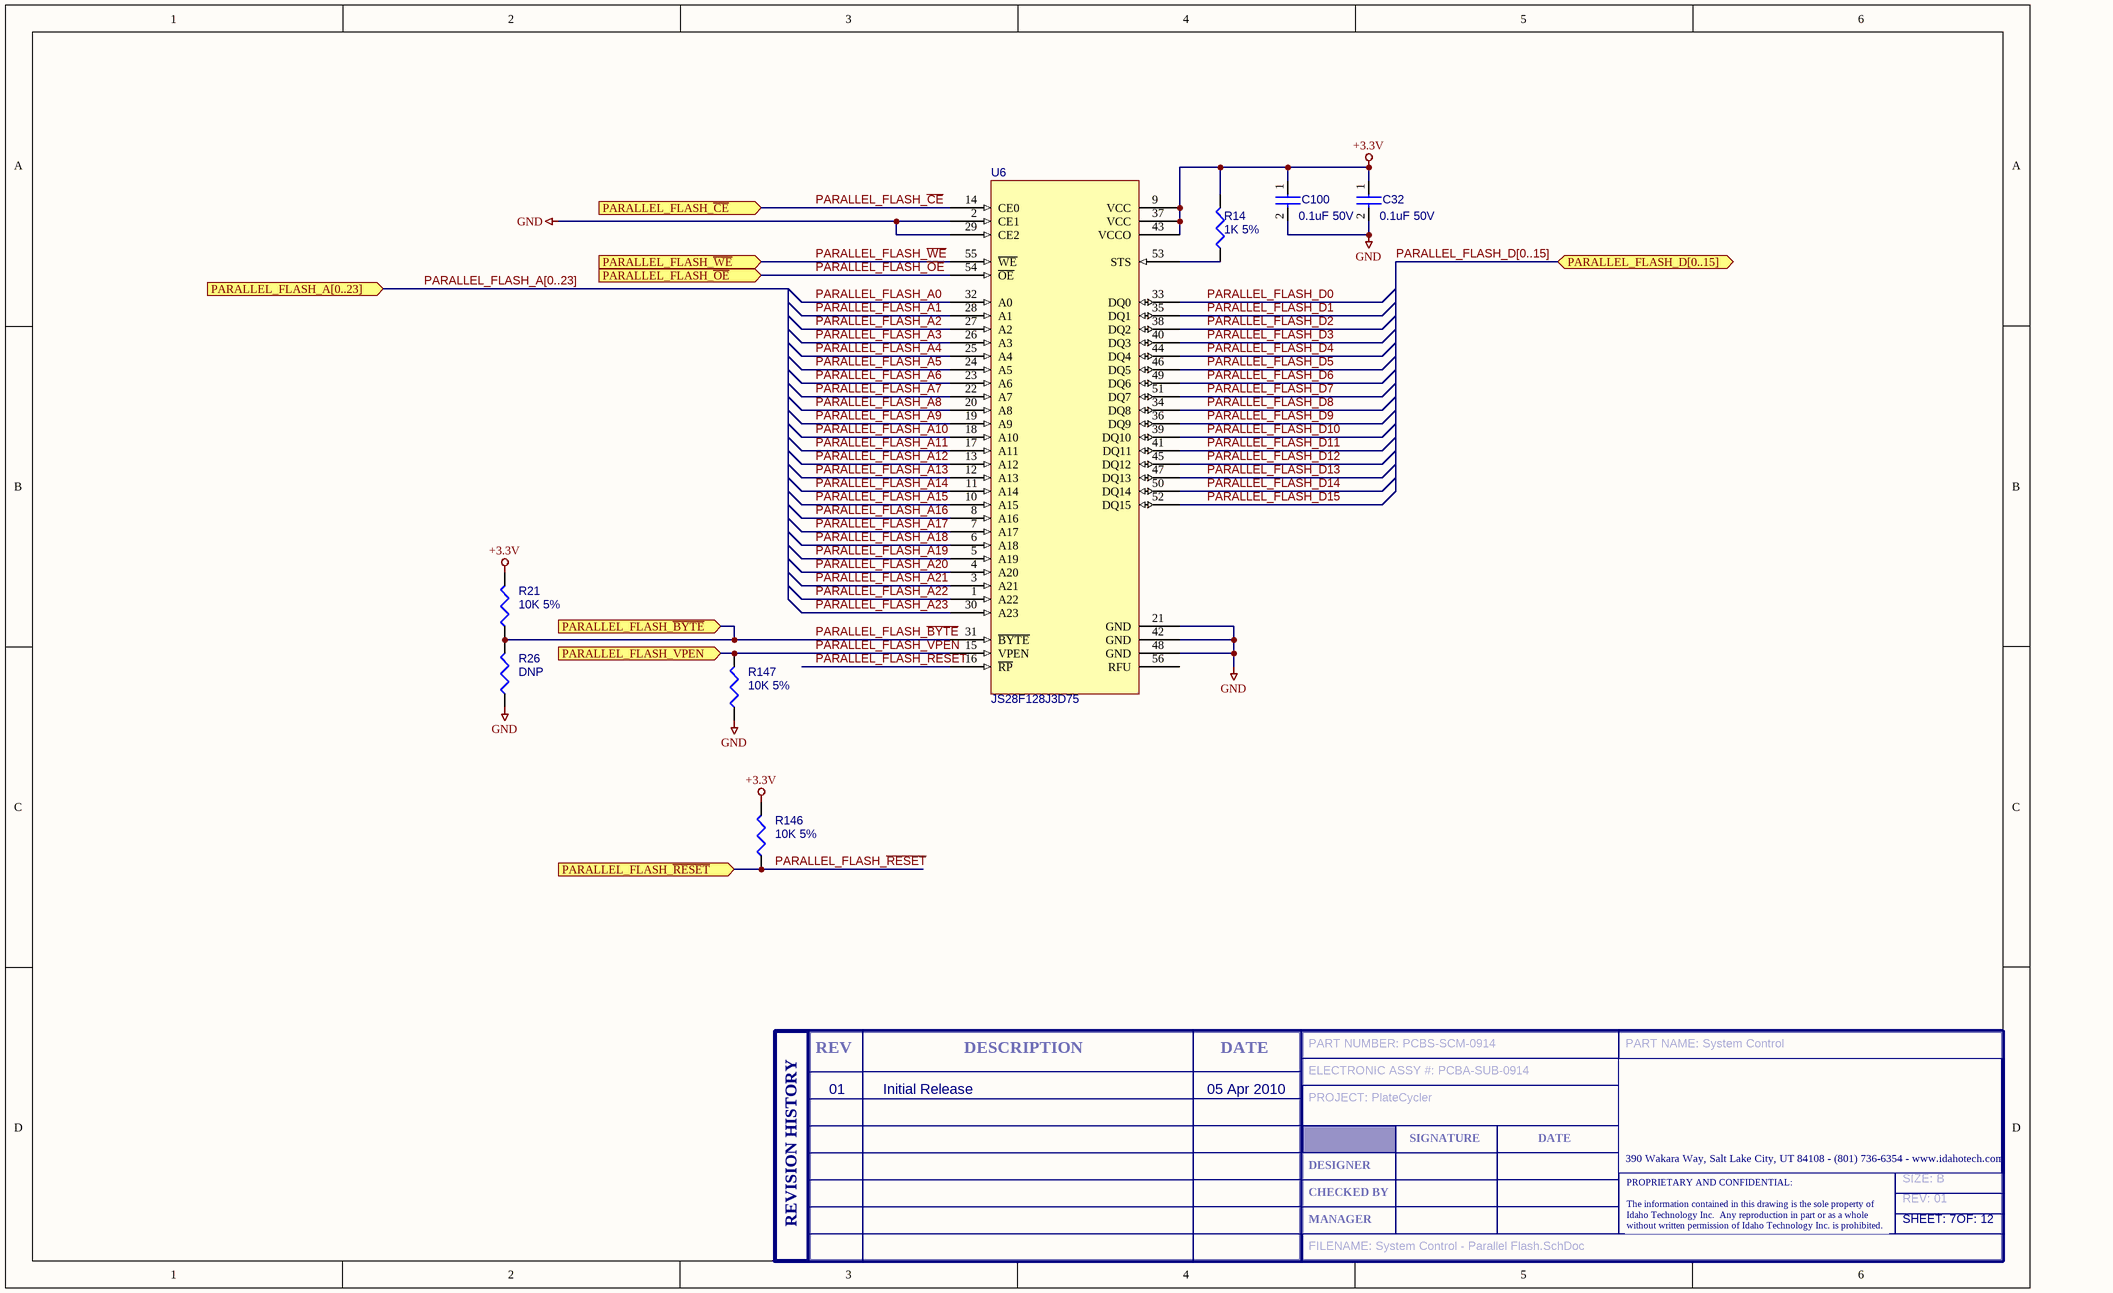
[diagram p7: System Control - Parallel Flash.SchDoc]

### Parts
(Parts that share a designator on the sheet are numbered #1, #2 ... from top to bottom, then left to right.)
C32  0.1uF 50V  [SM/C_0603]
C100  0.1uF 50V  [SM/C_0603]
R14  1K 5%  [SM/R_0603]
R21  10K 5%  [SM/R_0603]
R26  DNP  [SM/R_0603]  (no BOM)
R146  10K 5%  [SM/R_0603]
R147  10K 5%  [SM/R_0603]
T?#7  SIZE: B  REV: 01  FILENAME: System Control - Parallel Flash.SchDoc  PART NUMBER: PCBS-SCM-0914  PART NAME: System Control  ELECTRONIC ASSY #: PCBA-SUB-0914  PROJECT: PlateCycler  SHEET: 7  OF: 12  (hidden comment: ITI Title Block, A Size)  (graphical)
U6  JS28F128J3D75  [TSOP56]  (no BOM)

### Ports
PARALLEL_FLASH_A[0..23] (in), PARALLEL_FLASH_D[0..15] (bidir), PARALLEL_FLASH_VPEN (in), PARALLEL_FLASH_~{BYTE} (in), PARALLEL_FLASH_~{CE} (in), PARALLEL_FLASH_~{OE} (in), PARALLEL_FLASH_~{RESET} (in), PARALLEL_FLASH_~{WE} (in)

### Nets
+3.3V: C32.1 C100.1 R14.2 R21.2 R146.2 U6.9(VCC) U6.37(VCC) U6.43(VCCO)
GND: C32.2 C100.2 R26.1 R147.1 U6.2(CE1) U6.21(GND) U6.29(CE2) U6.42(GND) U6.48(GND)
PARALLEL_FLASH_A0: U6.32(A0)
PARALLEL_FLASH_A1: U6.28(A1)
PARALLEL_FLASH_A2: U6.27(A2)
PARALLEL_FLASH_A3: U6.26(A3)
PARALLEL_FLASH_A4: U6.25(A4)
PARALLEL_FLASH_A5: U6.24(A5)
PARALLEL_FLASH_A6: U6.23(A6)
PARALLEL_FLASH_A7: U6.22(A7)
PARALLEL_FLASH_A8: U6.20(A8)
PARALLEL_FLASH_A9: U6.19(A9)
PARALLEL_FLASH_A10: U6.18(A10)
PARALLEL_FLASH_A11: U6.17(A11)
PARALLEL_FLASH_A12: U6.13(A12)
PARALLEL_FLASH_A13: U6.12(A13)
PARALLEL_FLASH_A14: U6.11(A14)
PARALLEL_FLASH_A15: U6.10(A15)
PARALLEL_FLASH_A16: U6.8(A16)
PARALLEL_FLASH_A17: U6.7(A17)
PARALLEL_FLASH_A18: U6.6(A18)
PARALLEL_FLASH_A19: U6.5(A19)
PARALLEL_FLASH_A20: U6.4(A20)
PARALLEL_FLASH_A21: U6.3(A21)
PARALLEL_FLASH_A22: U6.1(A22)
PARALLEL_FLASH_A23: U6.30(A23)
PARALLEL_FLASH_~{BYTE}: R21.1 R26.2 U6.31(~{BYTE}) ; port PARALLEL_FLASH_~{BYTE}
PARALLEL_FLASH_~{CE}: U6.14(CE0) ; port PARALLEL_FLASH_~{CE}
PARALLEL_FLASH_D0: U6.33(DQ0)
PARALLEL_FLASH_D1: U6.35(DQ1)
PARALLEL_FLASH_D2: U6.38(DQ2)
PARALLEL_FLASH_D3: U6.40(DQ3)
PARALLEL_FLASH_D4: U6.44(DQ4)
PARALLEL_FLASH_D5: U6.46(DQ5)
PARALLEL_FLASH_D6: U6.49(DQ6)
PARALLEL_FLASH_D7: U6.51(DQ7)
PARALLEL_FLASH_D8: U6.34(DQ8)
PARALLEL_FLASH_D9: U6.36(DQ9)
PARALLEL_FLASH_D10: U6.39(DQ10)
PARALLEL_FLASH_D11: U6.41(DQ11)
PARALLEL_FLASH_D12: U6.45(DQ12)
PARALLEL_FLASH_D13: U6.47(DQ13)
PARALLEL_FLASH_D14: U6.50(DQ14)
PARALLEL_FLASH_D15: U6.52(DQ15)
PARALLEL_FLASH_~{OE}: U6.54(~{OE}) ; port PARALLEL_FLASH_~{OE}
PARALLEL_FLASH_~{RESET}: R146.1 U6.16(~{RP}) ; port PARALLEL_FLASH_~{RESET}
PARALLEL_FLASH_VPEN: R147.2 U6.15(VPEN) ; port PARALLEL_FLASH_VPEN
PARALLEL_FLASH_~{WE}: U6.55(~{WE}) ; port PARALLEL_FLASH_~{WE}
NetR14_1: R14.1 U6.53(STS)

Not connected (* = marked no-connect by the designer): U6 56(RFU)

### Buses and harness runs
bus PARALLEL_FLASH_A[0..23] = port PARALLEL_FLASH_A[0..23]
bus PARALLEL_FLASH_D[0..15] = port PARALLEL_FLASH_D[0..15]

### Notes on the sheet
- 01
- Initial Release
- 05 Apr 2010
- (in symbol ITI A-size Title Block and Rev Table) REV; DESCRIPTION; DATE; SIGNATURE; 390 Wakara Way, Salt Lake City, UT 84108 - (801) 736-6354 - www.idahotech.com; DESIGNER; CHECKED BY; REVISION HISTORY; MANAGER; PROPRIETARY AND CONFIDENTIAL: / The information contained in this drawing is the sole property of / Idaho Technology Inc.  Any reproduction in part or as a whole / without written permission of Idaho Technology Inc. is prohibited.

### Library data of the parts
C32 C100 = CAP NP_1: CAP CER .10UF 50V X7R 0603; Manufacturer P/N: UMK107B7104KA-T; Manufacturer: Taiyo Yuden; Vendor P/N: 587-1243-1-ND; Vendor: Digikey
R14 = R1K 5% 0603: RES 1.0K OHM 1/10W 5% 0603 SMD; Manufacturer: Panasonic; Manufacturer P/N: ERJ-3GEYJ102V; Vendor: Digikey; Vendor P/N: P1.0KGCT-ND
R21 R26 R146 R147 = R10K 5% 0603: RES 10K OHM 1/10W 5% 0603 SMD; Manufacturer: Panasonic; Manufacturer P/N: ERJ-3GEYJ103V; Vendor: Digikey; Vendor P/N: P10KGCT-ND
T?#7 = ITI A-size Title Block and Rev Table: ITI Title Block and Rev Table, A Size
U6 = JS28F128J3D75: Flash Mem Parallel 2.7V to 3.6V 128M-Bit 16M x 8/8M x 16 75ns 56-Pin TSOP; Manufacturer: Numonyx; Vendor: Avnet; Manufacturer P/N: JS28F128J3D75; Vendor P/N: JS28F128J3D75

## Sheet System Control - Power Supervisors.SchDoc
size B
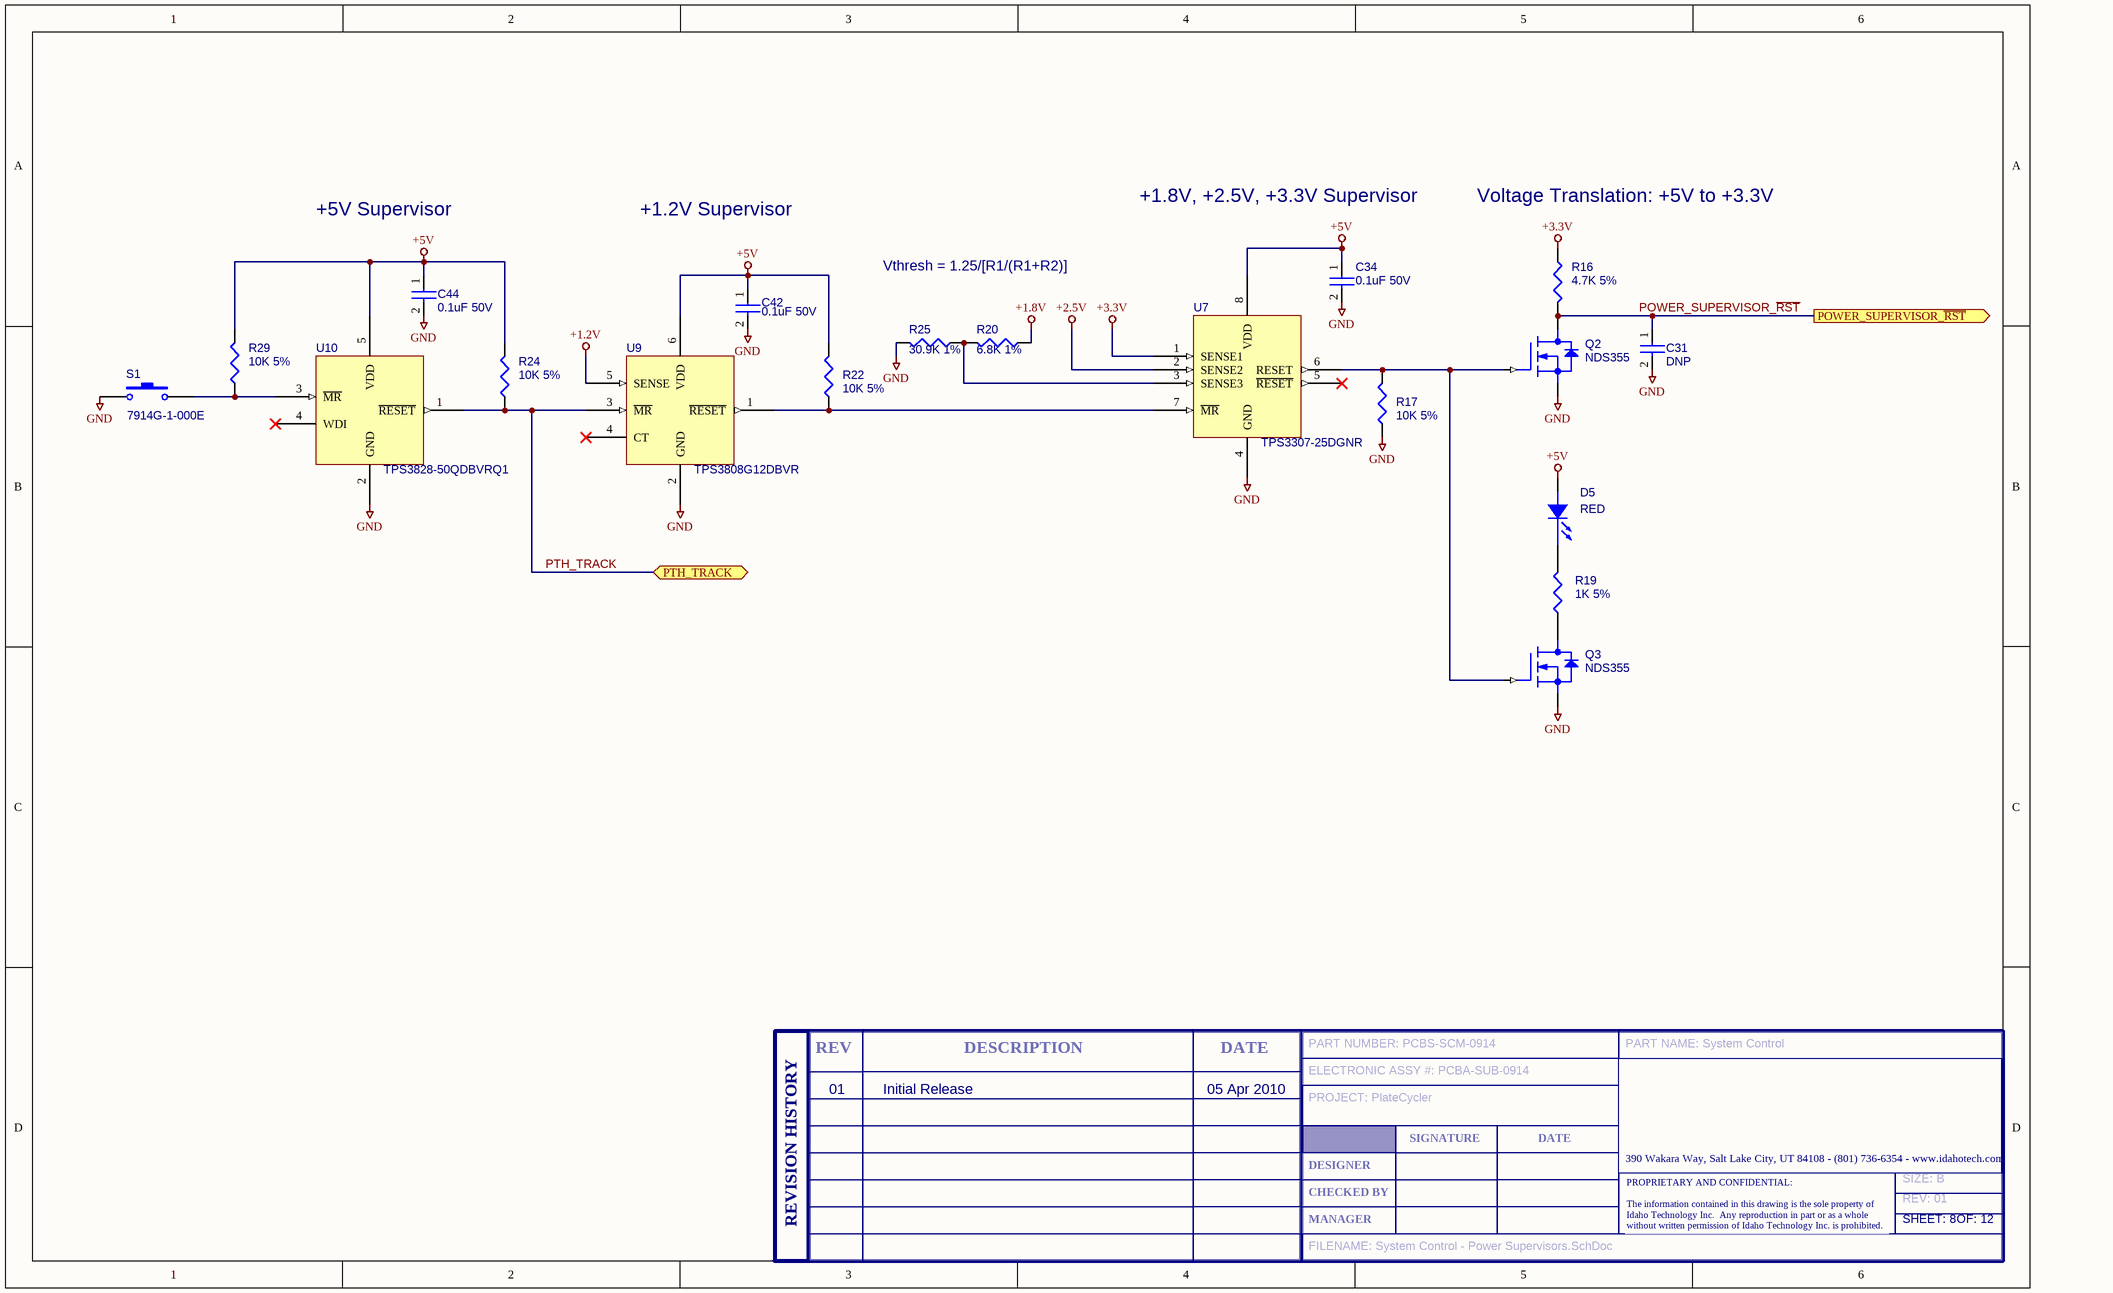
[diagram p8: System Control - Power Supervisors.SchDoc]

### Parts
(Parts that share a designator on the sheet are numbered #1, #2 ... from top to bottom, then left to right.)
C31  DNP  [SM/C_0603]  (no BOM)
C34  0.1uF 50V  [SM/C_0603]
C42  0.1uF 50V  [SM/C_0603]
C44  0.1uF 50V  [SM/C_0603]
D5  RED  [LED 1206]
Q2  NDS355  [TO236AA/SOT23]
Q3  NDS355  [TO236AA/SOT23]
R16  4.7K 5%  [SM/R_0603]
R17  10K 5%  [SM/R_0603]
R19  1K 5%  [SM/R_0603]
R20  6.8K 1%  [SM/R_0603]
R22  10K 5%  [SM/R_0603]
R24  10K 5%  [SM/R_0603]
R25  30.9K 1%  [SM/R_0603]
R29  10K 5%  [SM/R_0603]
S1  Manufacturer P/N: 7914G-1-000E  [PBSW SMD]  (hidden comment: SW-PB)
T?#8  SIZE: B  REV: 01  FILENAME: System Control - Power Supervisors.SchDoc  PART NUMBER: PCBS-SCM-0914  PART NAME: System Control  ELECTRONIC ASSY #: PCBA-SUB-0914  PROJECT: PlateCycler  SHEET: 8  OF: 12  (hidden comment: ITI Title Block, A Size)  (graphical)
U7  TPS3307-25DGNR  [MSOP8 PowerPAD]
U9  TPS3808G12DBVR  [SOT23-6]
U10  TPS3828-50QDBVRQ1  [SOT23-5]

### Ports
POWER_SUPERVISOR_~{RST} (out), PTH_TRACK

### Nets
+1.2V: U9.5(SENSE)
+1.8V: R20.1
+2.5V: U7.2(SENSE2)
+3.3V: R16.1 U7.1(SENSE1)
+5V: C34.1 C42.1 C44.1 D5.1(ANODE) R22.2 R24.2 R29.2 U7.8(VDD) U9.6(VDD) U10.5(VDD)
GND: C31.2 C34.2 C42.2 C44.2 Q2.2(SOURCE) Q3.2(SOURCE) R17.1 R25.2 S1.1 U7.4(GND) U9.2(GND) U10.2(GND)
POWER_SUPERVISOR_~{RST}: C31.1 Q2.3(DRAIN) R16.2 ; port POWER_SUPERVISOR_~{RST}
PTH_TRACK: R24.1 U9.3(~{MR}) U10.1(~{RESET}) ; port PTH_TRACK
NetD5_2: D5.2(CATHODE) R19.2
NetQ2_1: Q2.1(GATE) Q3.1(GATE) R17.2 U7.6(RESET)
NetQ3_3: Q3.3(DRAIN) R19.1
NetR20_2: R20.2 R25.1 U7.3(SENSE3)
NetR22_1: R22.1 U7.7(~{MR}) U9.1(~{RESET})
NetR29_1: R29.1 S1.2 U10.3(~{MR})

Not connected (* = marked no-connect by the designer): U7 5(~{RESET})*; U9 4(CT)*; U10 4(WDI)*

### Notes on the sheet
- +5V Supervisor
- +1.2V Supervisor
- +1.8V, +2.5V, +3.3V Supervisor
- Voltage Translation: +5V to +3.3V
- Vthresh = 1.25/[R1/(R1+R2)]
- 01
- Initial Release
- 05 Apr 2010
- (in symbol ITI A-size Title Block and Rev Table) REV; DESCRIPTION; DATE; SIGNATURE; 390 Wakara Way, Salt Lake City, UT 84108 - (801) 736-6354 - www.idahotech.com; DESIGNER; CHECKED BY; REVISION HISTORY; MANAGER; PROPRIETARY AND CONFIDENTIAL: / The information contained in this drawing is the sole property of / Idaho Technology Inc.  Any reproduction in part or as a whole / without written permission of Idaho Technology Inc. is prohibited.

### Library data of the parts
C31 C34 C42 C44 = CAP NP_1: as C32 on sheet System Control - Parallel Flash
D5 = LED: LED 635NM RED WTR CLR 1206 SMD; Manufacturer: Lumex; Manufacturer P/N: SML-LX1206IC-TR; Vendor: Digikey; Vendor P/N: 67-1356-1-ND
Q2 Q3 = NDS355N/SOT: MOSFET N-CH 30V 1.6A SOT-23; Manufacturer: Fairchild Semiconductor; Vendor: Digikey; Vendor P/N: NDS355NCT-ND; Manufacturer P/N: NDS355N
R16 = R4.7K 5% 0603: RES 4.7K OHM 1/10W 5% 0603 SMD; Manufacturer P/N: ERJ-3GEYJ472V; Manufacturer: Panasonic; Vendor: Digikey; Vendor P/N: P4.7KGCT-ND
R17 R22 R24 R29 = R10K 5% 0603: as R21 on sheet System Control - Parallel Flash
R19 = R1K 5% 0603: as R14 on sheet System Control - Parallel Flash
R20 = R1K 5% 0603: RES 6.80K OHM 1/10W 1% 0603 SMD; Manufacturer: Panasonic; Manufacturer P/N: ERJ-3EKF6801V; Vendor: Digikey; Vendor P/N: P6.80KHCT-ND
R25 = R1K 5% 0603: RES 30.9K OHM 1/10W 1% 0603 SMD; Manufacturer: Panasonic; Manufacturer P/N: ERJ-3EKF3092V; Vendor: Digikey; Vendor P/N: P30.9KHCT-ND
S1 = SW-PB: SWITCH KEY 4MM SQ SMD GULL WING; Manufacturer: Bourns; Vendor P/N: 7914G-000ECT-ND; Vendor: Digikey
T?#8 = ITI A-size Title Block and Rev Table: ITI Title Block and Rev Table, A Size
U7 = TPS3307-25DGNR: IC 3.3/2.5V/ADJ TPL MONIT 8-MSOP; Manufacturer: Texas Instruments; Vendor P/N: 296-3313-1-ND; Vendor: Digikey; Manufacturer P/N: TPS3307-25DGNR
U9 = TPS3808G12DBVR: IC VOLT SUPERVISOR 1.2V SOT23-6; Manufacturer: Texas Instruments; Vendor P/N: 296-17190-1-ND; Vendor: Digikey; Manufacturer P/N: TPS3808G12DBVR
U10 = TPS3828-50QDBVRQ1: IC 4.55V SUPPLY MONITOR SOT23-5; Manufacturer: Texas Instrument; Vendor P/N: 296-15659-1-ND; Vendor: Digikey; Manufacturer P/N: TPS3828-50QDBVRQ1

## Sheet System Control - Power.SchDoc
size C
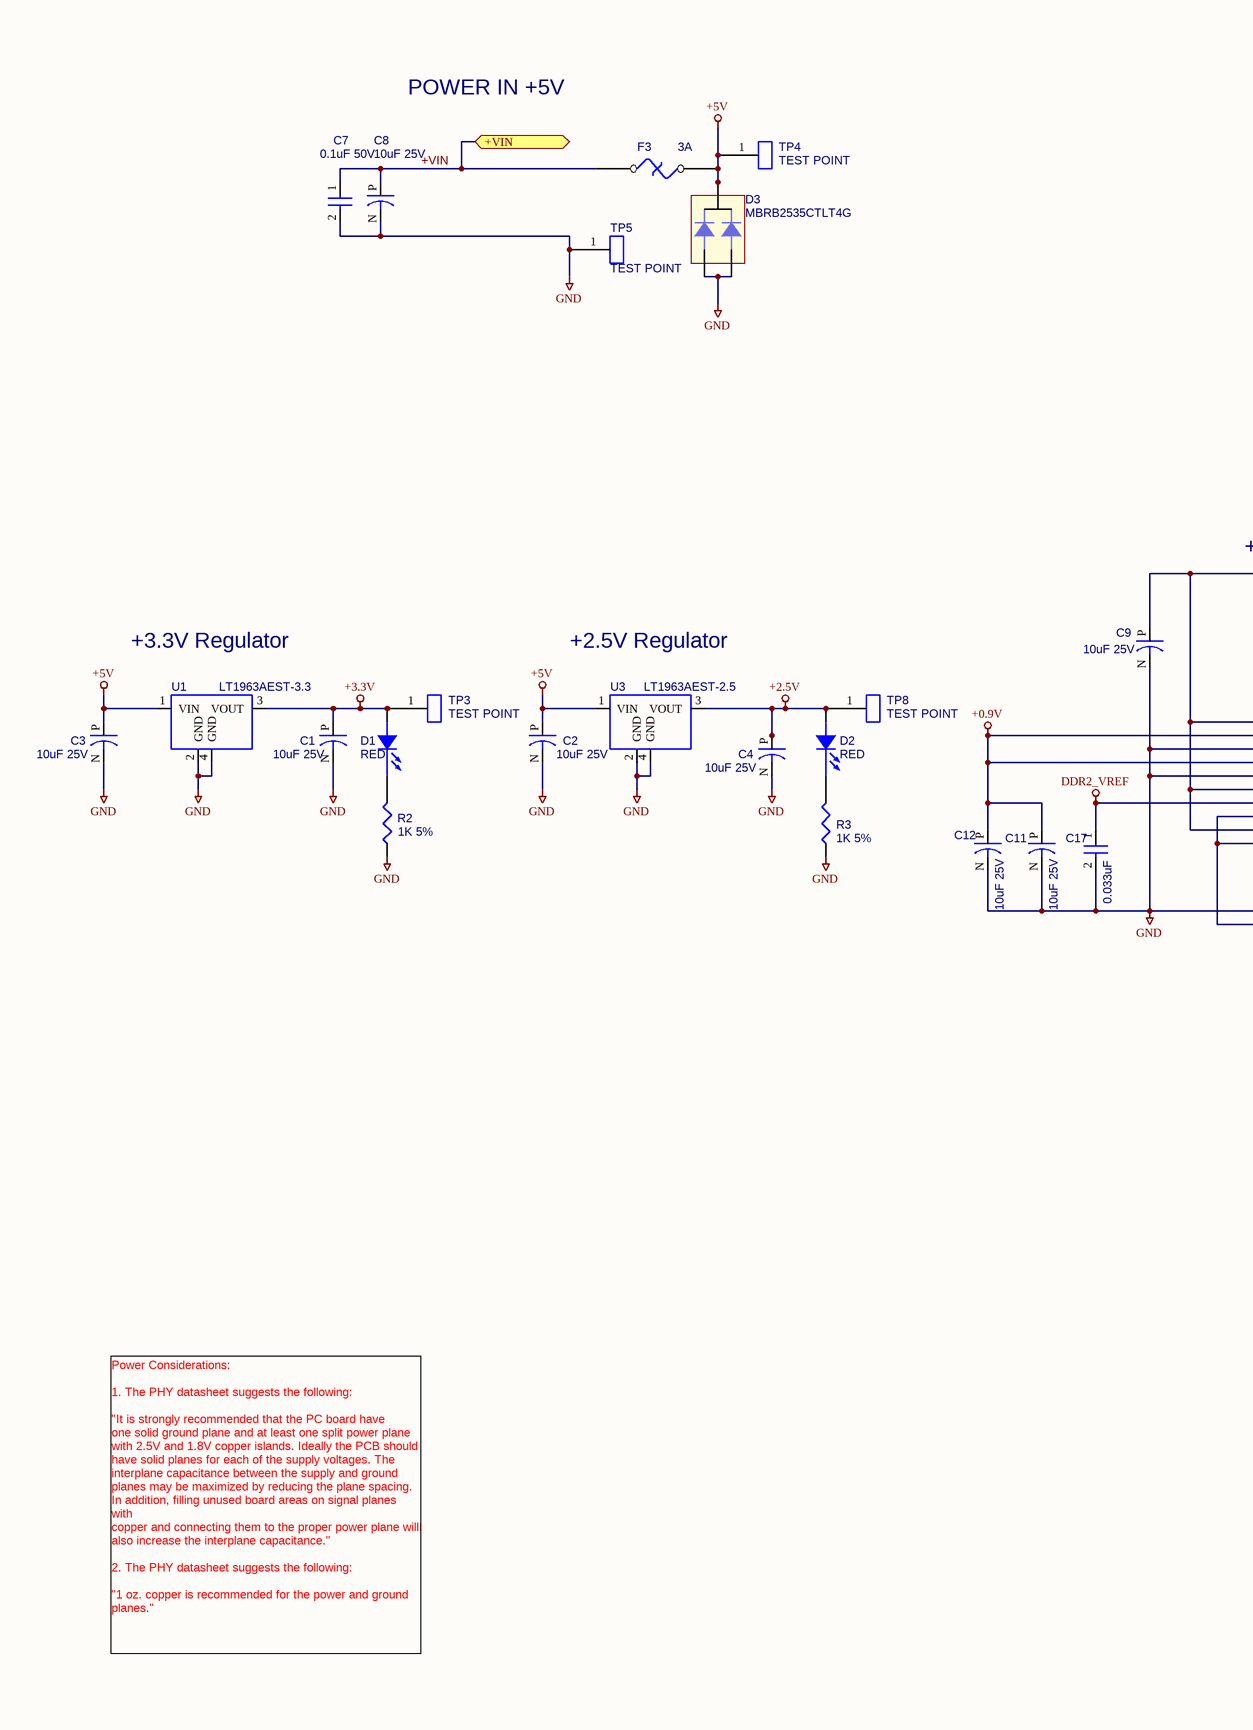
[diagram p9: System Control - Power.SchDoc, left]
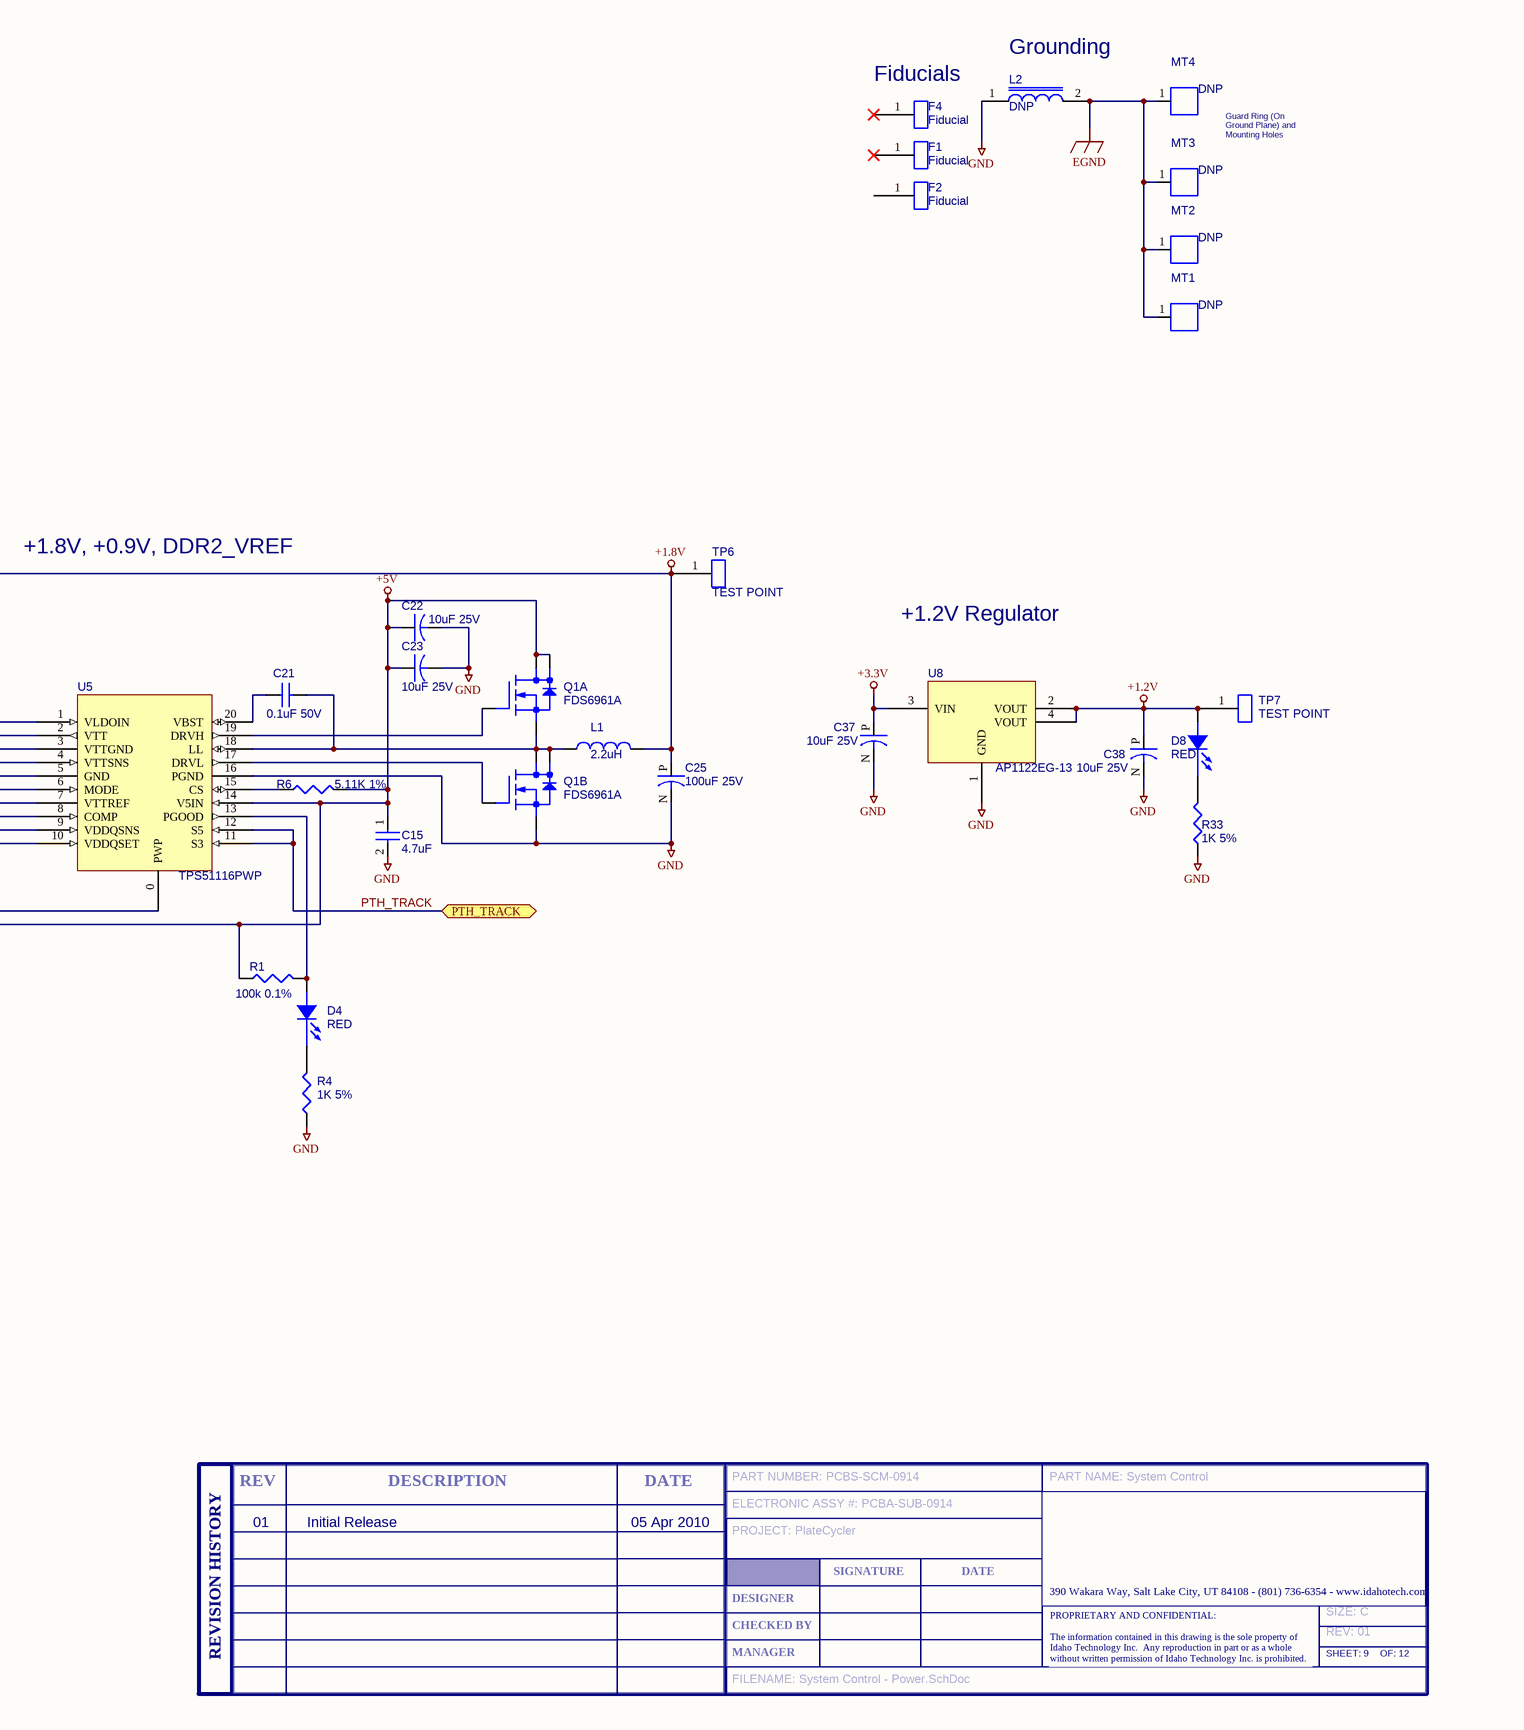
[diagram p10: System Control - Power.SchDoc, right]

### Parts
(Parts that share a designator on the sheet are numbered #1, #2 ... from top to bottom, then left to right.)
C1  10uF 25V  [SM/CT_6032]
C2  10uF 25V  [SM/CT_6032]
C3  10uF 25V  [SM/CT_6032]
C4  10uF 25V  [SM/CT_6032]
C7  0.1uF 50V  [SM/C_1206]
C8  10uF 25V  [SM/CT_6032]
C9  10uF 25V  [SM/CT_6032]
C11  10uF 25V  [SM/CT_6032]
C12  10uF 25V  [SM/CT_6032]
C15  4.7uF  [SM/C_0603]
C17  0.033uF  [SM/C_0603]
C21  0.1uF 50V  [SM/C_0603]
C22  10uF 25V  [SM/CT_6032]
C23  10uF 25V  [SM/CT_6032]
C25  100uF 25V  [SM/CT_7360]
C37  10uF 25V  [SM/CT_6032]
C38  10uF 25V  [SM/CT_6032]
D1  RED  [LED 1206]
D2  RED  [LED 1206]
D3  MBRB2535CTLT4G  [D2PAK]
D4  RED  [LED 1206]
D8  RED  [LED 1206]
F1  Fiducial  [FIDUCAL]  (no BOM)
F2  Fiducial  [FIDUCAL]  (no BOM)
F3  3A  [SMD - Fuse]
F4  Fiducial  [FIDUCAL]  (no BOM)
L1  2.2uH  [IHLP-1616BZ-11]
L2  DNP  [TDX Inductor]  (no BOM)
MT1  DNP  [STANDOFF_0.156]  (no BOM)
MT2  DNP  [STANDOFF_0.156]  (no BOM)
MT3  DNP  [STANDOFF_0.156]  (no BOM)
MT4  DNP  [STANDOFF_0.156]  (no BOM)
Q1  FDS6961A  [SO8W_M]  (parts A,B of 2)
R1  100k 0.1%  [SM/R_0805]
R2  1K 5%  [SM/R_0603]
R3  1K 5%  [SM/R_0603]
R4  1K 5%  [SM/R_0603]
R6  5.11K 1%  [SM/R_0603]
R33  1K 5%  [SM/R_0603]
T?#9  SIZE: C  REV: 01  FILENAME: System Control - Power.SchDoc  PART NUMBER: PCBS-SCM-0914  PART NAME: System Control  ELECTRONIC ASSY #: PCBA-SUB-0914  PROJECT: PlateCycler  SHEET: 9  OF: 12  (hidden comment: ITI Title Block, A Size)  (graphical)
TP3  TEST POINT  [BLKCON.100/VH/TM1SQ/W.100/1]
TP4  TEST POINT  [BLKCON.100/VH/TM1SQ/W.100/1]
TP5  TEST POINT  [BLKCON.100/VH/TM1SQ/W.100/1]
TP6  TEST POINT  [BLKCON.100/VH/TM1SQ/W.100/1]
TP7  TEST POINT  [BLKCON.100/VH/TM1SQ/W.100/1]
TP8  TEST POINT  [BLKCON.100/VH/TM1SQ/W.100/1]
U1  LT1963AEST-3.3  [SM/SOT223_1234]
U3  LT1963AEST-2.5  [SM/SOT223_1234]
U5  TPS51116PWP  [TSSOP20 - PWP]
U8  AP1122EG-13  [SM/SOT223_1234]

### Ports
+VIN, PTH_TRACK

### Nets
+0.9V: C11.P C12.P U5.2(VTT) U5.4(VTTSNS)
+1.2V: C38.P D8.1(ANODE) TP7.1 U8.2(VOUT) U8.4(VOUT)
+1.8V: C9.P C25.P L1.2 TP6.1 U5.1(VLDOIN) U5.6(MODE) U5.9(VDDQSNS)
+2.5V: C4.P D2.1(ANODE) TP8.1 U3.3(VOUT)
+3.3V: C1.P C37.P D1.1(ANODE) TP3.1 U1.3(VOUT) U8.3(VIN)
+5V: C2.P C3.P C15.1 C22.P C23.P D3.2 F3.2 Q1.7(D1) Q1.8(D1) R1.1 R6.2 TP4.1 U1.1(VIN) U3.1(VIN) U5.8(COMP) U5.10(VDDQSET) U5.14(V5IN)
DDR2_VREF: C17.1 U5.7(VTTREF)
EGND: L2.2 MT1.1 MT2.1 MT3.1 MT4.1
GND: C1.N C2.N C3.N C4.N C7.2 C8.N C9.N C11.N C12.N C15.2 C17.2 C22.N C23.N C25.N C37.N C38.N D3.1 D3.3 L2.1 Q1.3(S2) R2.1 R3.1 R4.1 R33.1 TP5.1 U1.2(GND) U1.4(GND) U3.2(GND) U3.4(GND) U5.0(PWP) U5.3(VTTGND) U5.5(GND) U5.16(PGND) U8.1(GND)
+VIN: C7.1 C8.P F3.1 ; port +VIN
PTH_TRACK: U5.11(S3) U5.12(S5) ; port PTH_TRACK
NetC21_1: C21.1 U5.20(VBST)
NetC21_2: C21.2 L1.1 Q1.1(S1) Q1.5(D2) Q1.6(D2) U5.18(LL)
NetD1_2: D1.2(CATHODE) R2.2
NetD2_2: D2.2(CATHODE) R3.2
NetD4_1: D4.1(ANODE) R1.2 U5.13(PGOOD)
NetD4_2: D4.2(CATHODE) R4.2
NetD8_2: D8.2(CATHODE) R33.2
NetQ1_2: Q1.2(G1) U5.19(DRVH)
NetQ1_4: Q1.4(G2) U5.17(DRVL)
NetR6_1: R6.1 U5.15(CS)

Not connected (* = marked no-connect by the designer): F1 1*; F2 1; F4 1*

### Notes on the sheet
- (near L2) Grounding
- POWER IN +5V
- Fiducials
- Guard Ring (On
  Ground Plane) and
  Mounting Holes
- +1.8V, +0.9V, DDR2_VREF
- +3.3V Regulator
- +2.5V Regulator
- +1.2V Regulator
- 01
- Initial Release
- 05 Apr 2010
- Power Considerations:
  1. The PHY datasheet suggests the following:
  "It is strongly recommended that the PC board have
  one solid ground plane and at least one split power plane
  with 2.5V and 1.8V copper islands. Ideally the PCB should
  have solid planes for each of the supply voltages. The
  interplane capacitance between the supply and ground
  planes may be maximized by reducing the plane spacing.
  In addition, filling unused board areas on signal planes with
  copper and connecting them to the proper power plane will
  also increase the interplane capacitance."
  2. The PHY datasheet suggests the following:
  "1 oz. copper is recommended for the power and ground planes."
- (in symbol ITI A-size Title Block and Rev Table) REV; DESCRIPTION; DATE; SIGNATURE; 390 Wakara Way, Salt Lake City, UT 84108 - (801) 736-6354 - www.idahotech.com; DESIGNER; CHECKED BY; REVISION HISTORY; MANAGER; PROPRIETARY AND CONFIDENTIAL: / The information contained in this drawing is the sole property of / Idaho Technology Inc.  Any reproduction in part or as a whole / without written permission of Idaho Technology Inc. is prohibited.

### Library data of the parts
C1-C4 C8 C9 C11 C12 C22 C23 C37 C38 = CAP_1: SMD Tantalum Capacitors 10uF 25V 20% L ESR; Manufacturer P/N: TPSC106M025R0500; Manufacturer: AVX; Vendor P/N: 581-TPSC106M025R0500; Vendor: Mouser
C7 = CAP NP_1: CAP .1UF 50V CERM CHIP 1206 X7R; Manufacturer P/N: ECJ-3VB1H104K; Manufacturer: Panasonic; Vendor P/N: PCC104BCT-ND; Vendor: Digikey
C15 = CAP NP_1: CAP CER 4.7UF 10V Y5V 0603; Manufacturer P/N: GRM188F51A475ZE20D; Manufacturer: Murata; Vendor P/N: 490-3302-1-ND; Vendor: Digikey
C17 = CAP NP_1: CAP .033UF 50V CERAMIC X7R 0603; Manufacturer P/N: ECJ-1VB1H333K; Manufacturer: Panasonic; Vendor P/N: PCC2284CT-ND; Vendor: Digikey
C21 = CAP NP_1: as C32 on sheet System Control - Parallel Flash
C25 = CAP_1: CAPACITOR TANT 100UF 25V 20% SMD; Manufacturer: Kemet; Manufacturer P/N: T510E107M025AT E050; Vendor: Digikey; Vendor P/N: 399-3989-1-ND
D1 D2 D4 D8 = LED: as D5 on sheet System Control - Power Supervisors
D3 = MBRB2535CTLT4G: On Semi Switchmode Power Rectifier; Manufacturer: On Semiconductor; Rated Voltage: 35 V; Vendor: Digikey; Vendor P/N: MBRB2535CTLT4GOSCT-ND; Rated Amps: 25 A; Manufacturer P/N: MBRB2535CTLT4G
F1 F2 F4 = TEST POINT
F3 = FUSE THERMAL: FUSEBLOCK W/3A FUSE SMD FAST; Manufacturer P/N: 0154003.DR; Manufacturer: Littelfuse Inc; Vendor P/N: F1226CT-ND; Vendor: Digikey; Price: 2.62
L1 = INDUCTOR: INDUCTOR POWER 2.2UH 3.25A SMD; Manufacturer P/N: IHLP1616BZER2R2M11; Manufacturer: Vishay/Dale; Vendor P/N: 541-1050-1-ND; Vendor: Digikey
L2 = TDK Inductor: INDUCTOR WW PWR 47UH 260MA 10%; Manufacturer P/N: NLC453232T-470K-PF; Manufacturer: TDK; Vendor P/N: 445-1964-1-ND; Vendor: Digikey
MT1 = CON1_0: Right: 20; COMPGROUP: 1; COMPSIDE: TOP; COMPLOC: [165.000,4835.000]; COMPROT: 0; COMPFIXED: NO; COMPHEIGHT: 0.000; Bottom: 20; COMPLOCKED: NO; COMPKEY: NO; DECOUPLER: NO; MEMORY: NO
MT2 = CON1_0: Right: 20; COMPGROUP: 1; COMPSIDE: TOP; COMPLOC: [6834.000,4835.000]; COMPROT: 0; COMPFIXED: NO; COMPHEIGHT: 0.000; Bottom: 20; COMPLOCKED: NO; COMPKEY: NO; DECOUPLER: NO; MEMORY: NO
MT3 = CON1_0: Right: 20; COMPGROUP: 1; COMPSIDE: TOP; COMPLOC: [165.000,165.000]; COMPROT: 0; COMPFIXED: NO; COMPHEIGHT: 0.000; Bottom: 20; COMPLOCKED: NO; COMPKEY: NO; DECOUPLER: NO; MEMORY: NO
MT4 = CON1_0: Right: 20; COMPHEIGHT: 0.000; MEMORY: NO; COMPROT: 0; COMPLOC: [6834.000,165.000]; COMPSIDE: TOP; COMPGROUP: 1; Bottom: 20; DECOUPLER: NO; COMPKEY: NO; COMPLOCKED: NO; COMPFIXED: NO
Q1 = FDS6961A: MOSFET N-CH DUAL 30V 3.5A 8SOIC; Manufacturer: Fairchild Semiconductor; Vendor: Digikey; Vendor P/N: FDS6961ACT-ND; Manufacturer P/N: FDS6961A
R1 = RESISTOR_0_Dup1: RES 100K OHM 1/10W .1% 0805 SMD; Manufacturer: Panasonic; Manufacturer P/N: ERA-6YEB104V; Vendor: Digikey; Vendor P/N: P100KZCT-ND
R2-R4 = R1K 5% 0603: RES 1.0K OHM 1/10W 5% 0603 SMD; Manufacturer: Panasonic; Manufacturer P/N: ERJ-3GEYJ102V; Vendor P/N: P1.0KGCT-ND; Vendor P/N: Digikey
R6 = RESISTOR_0_Dup1: RES 5.11K OHM 1/10W 1% 0603 SMD; Manufacturer: Panasonic; Manufacturer P/N: ERJ-3EKF5111V; Vendor: Digikey; Vendor P/N: P5.11KHCT-ND
R33 = R1K 5% 0603: RES 1.0K OHM 1/10W 5% 0603 SMD; Manufacturer: Panasonic; Manufacturer P/N: ERJ-3GEYJ102V; Vendor P/N: P1.0KGCT-ND; Vendor: Digikey
T?#9 = ITI A-size Title Block and Rev Table: ITI Title Block and Rev Table, A Size
TP3 TP4 TP6-TP8 = TEST POINT: TEST POINT PC MINI .040"D RED; Manufacturer P/N: 5000; Manufacturer: Keystone Electronics; Vendor P/N: 5000K-ND; Vendor: Digikey
TP5 = TEST POINT: TEST POINT PC MINI .040"D BLACK; Manufacturer P/N: 5001; Manufacturer: Keystone Electronics; Vendor P/N: 5001K-ND; Vendor: Digikey
U1 = LT1963A: IC REG LDO LN 1.5A 3.3V SOT-223; Manufacturer P/N: LT1963AEST-3.3#PBF; Manufacturer: Linear Technology; Vendor P/N: LT1963AEST-3.3#PBF-ND; Vendor: Digikey
U3 = LT1963A: IC REG LDO LN 1.5A 2.5V SOT223-3; Manufacturer P/N: LT1963AEST-2.5#PBF; Manufacturer: Linear Technology; Vendor P/N: LT1963AEST-2.5#PBF-ND; Vendor: Digikey
U5 = TPS51116PWP: Controllers - DC/DC DDR2 SWITCHER AND LDO; Manufacturer: Texas Instruments; Vendor P/N: 595-TPS51116PWP; Vendor: Mouser; Manufacturer P/N: TPS51116PWP
U8 = AP1122EG-13: IC REG LDO 1.0A POS SOT223; Manufacturer: Diodes Inc; Vendor: Digikey; Vendor P/N: AP1122EGDICT-ND; Manufacturer P/N: AP1122EG-13; Desc: IC REG LDO 1.0A POS SOT223; Price: 1.05

## Sheet System Control - SDRAM.SchDoc
size C
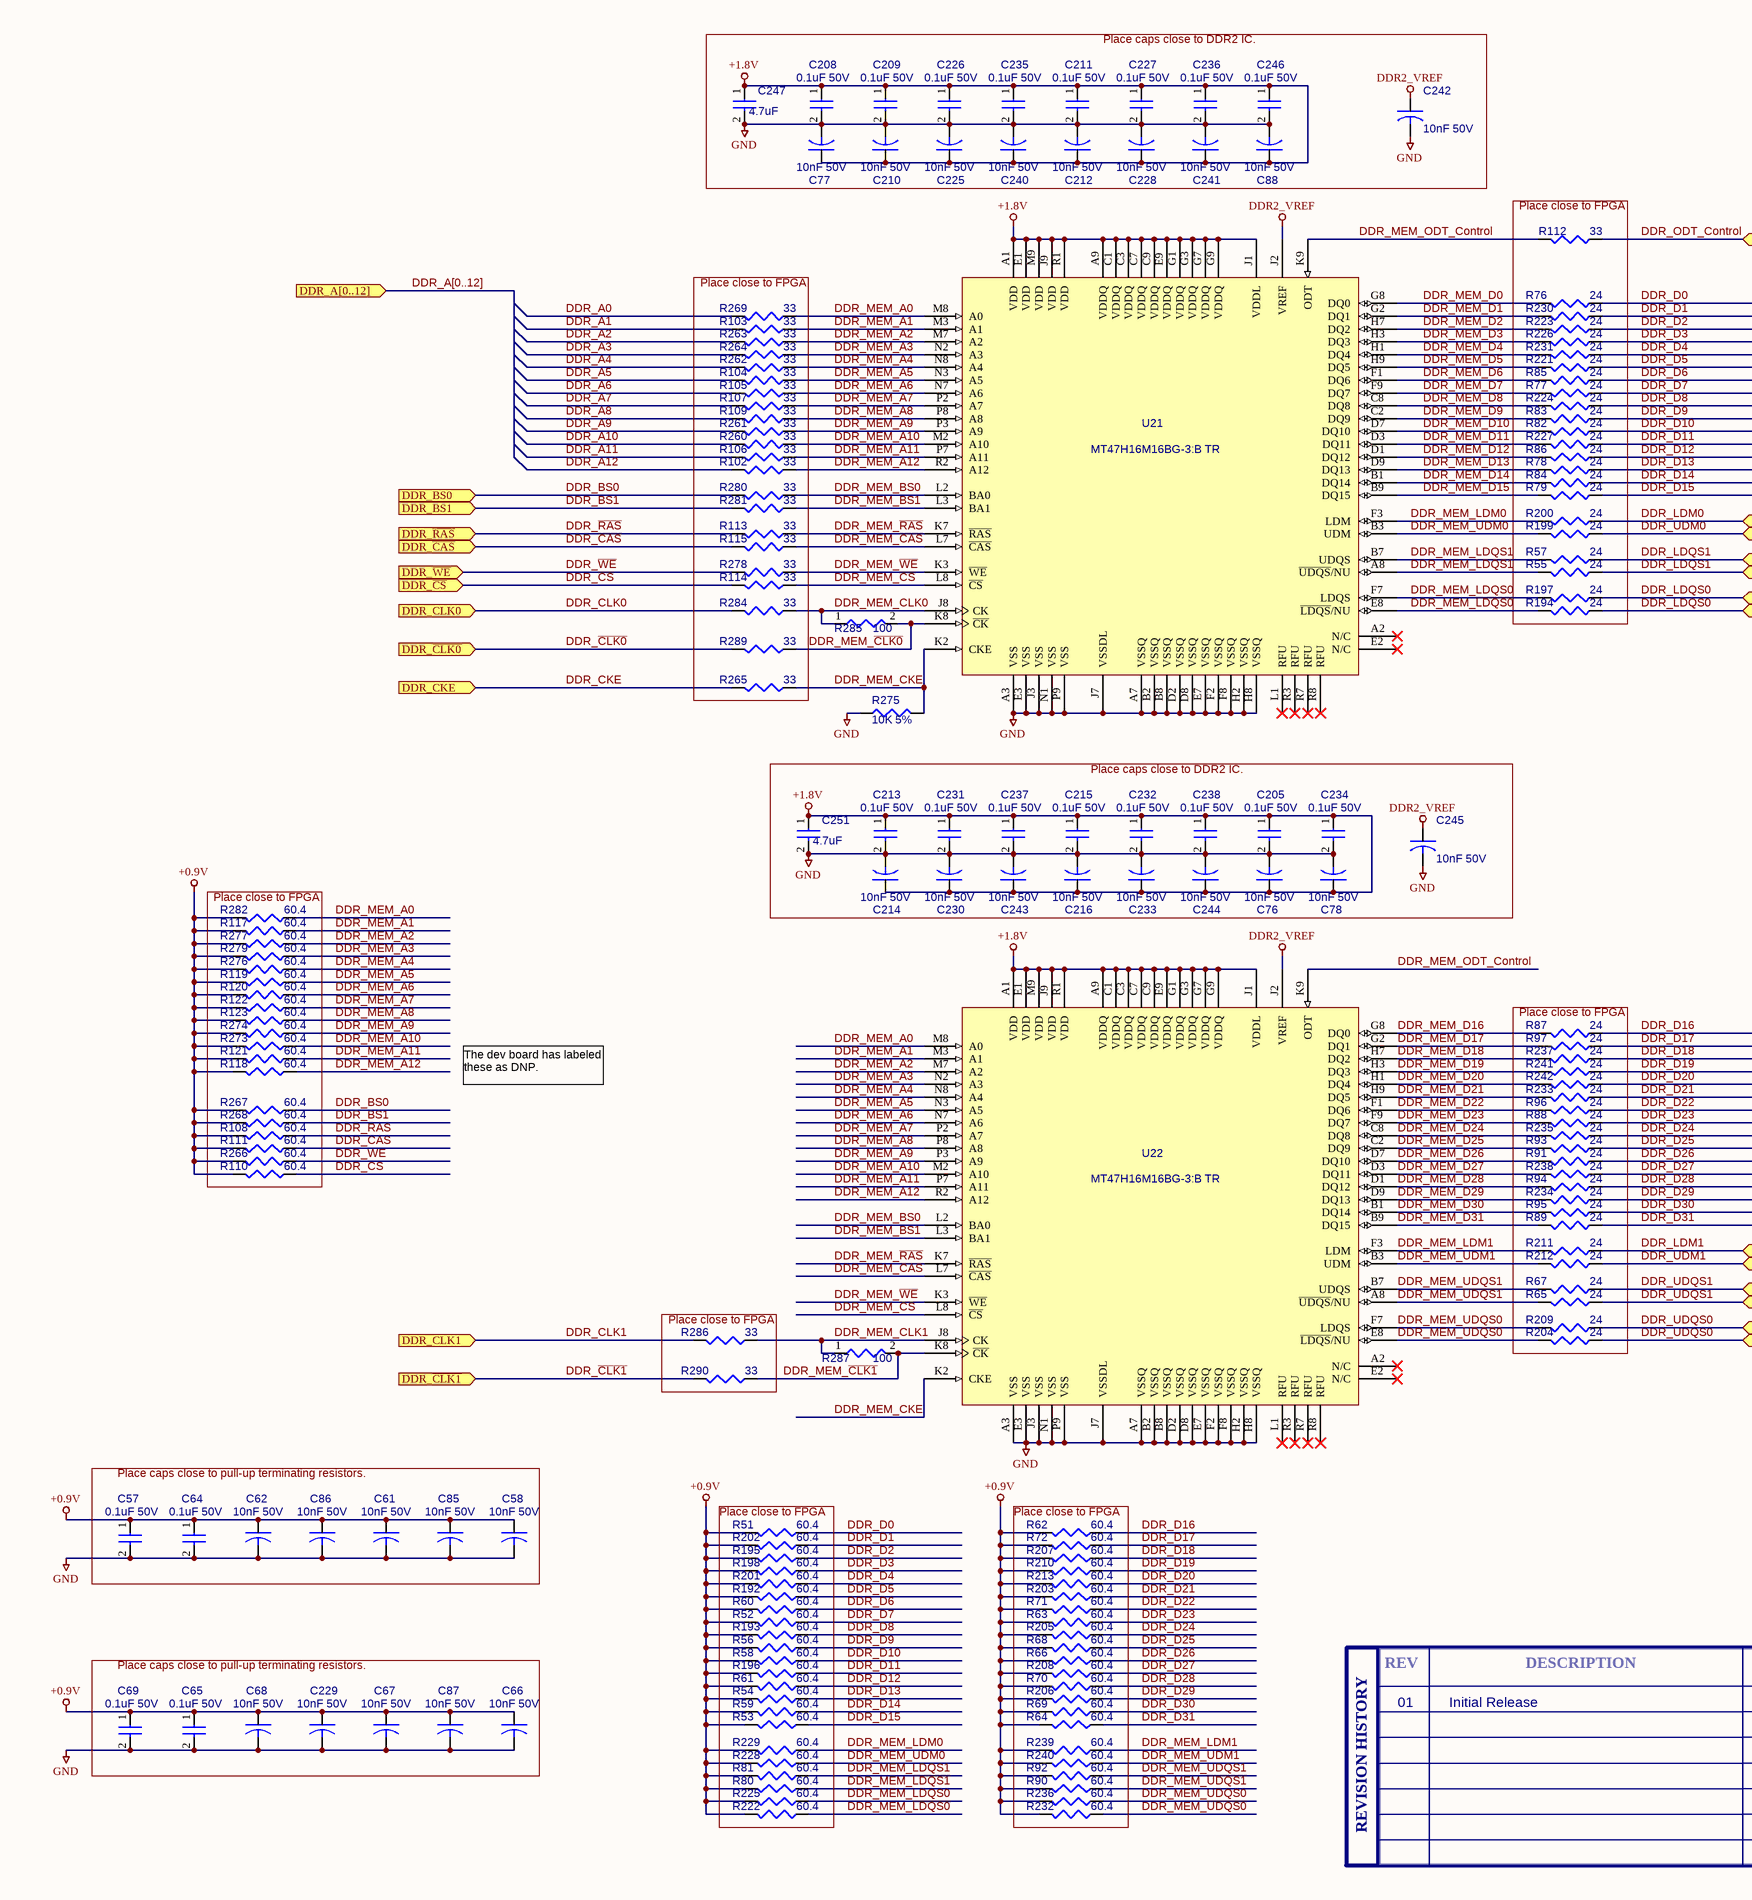
[diagram p11: System Control - SDRAM.SchDoc, left]
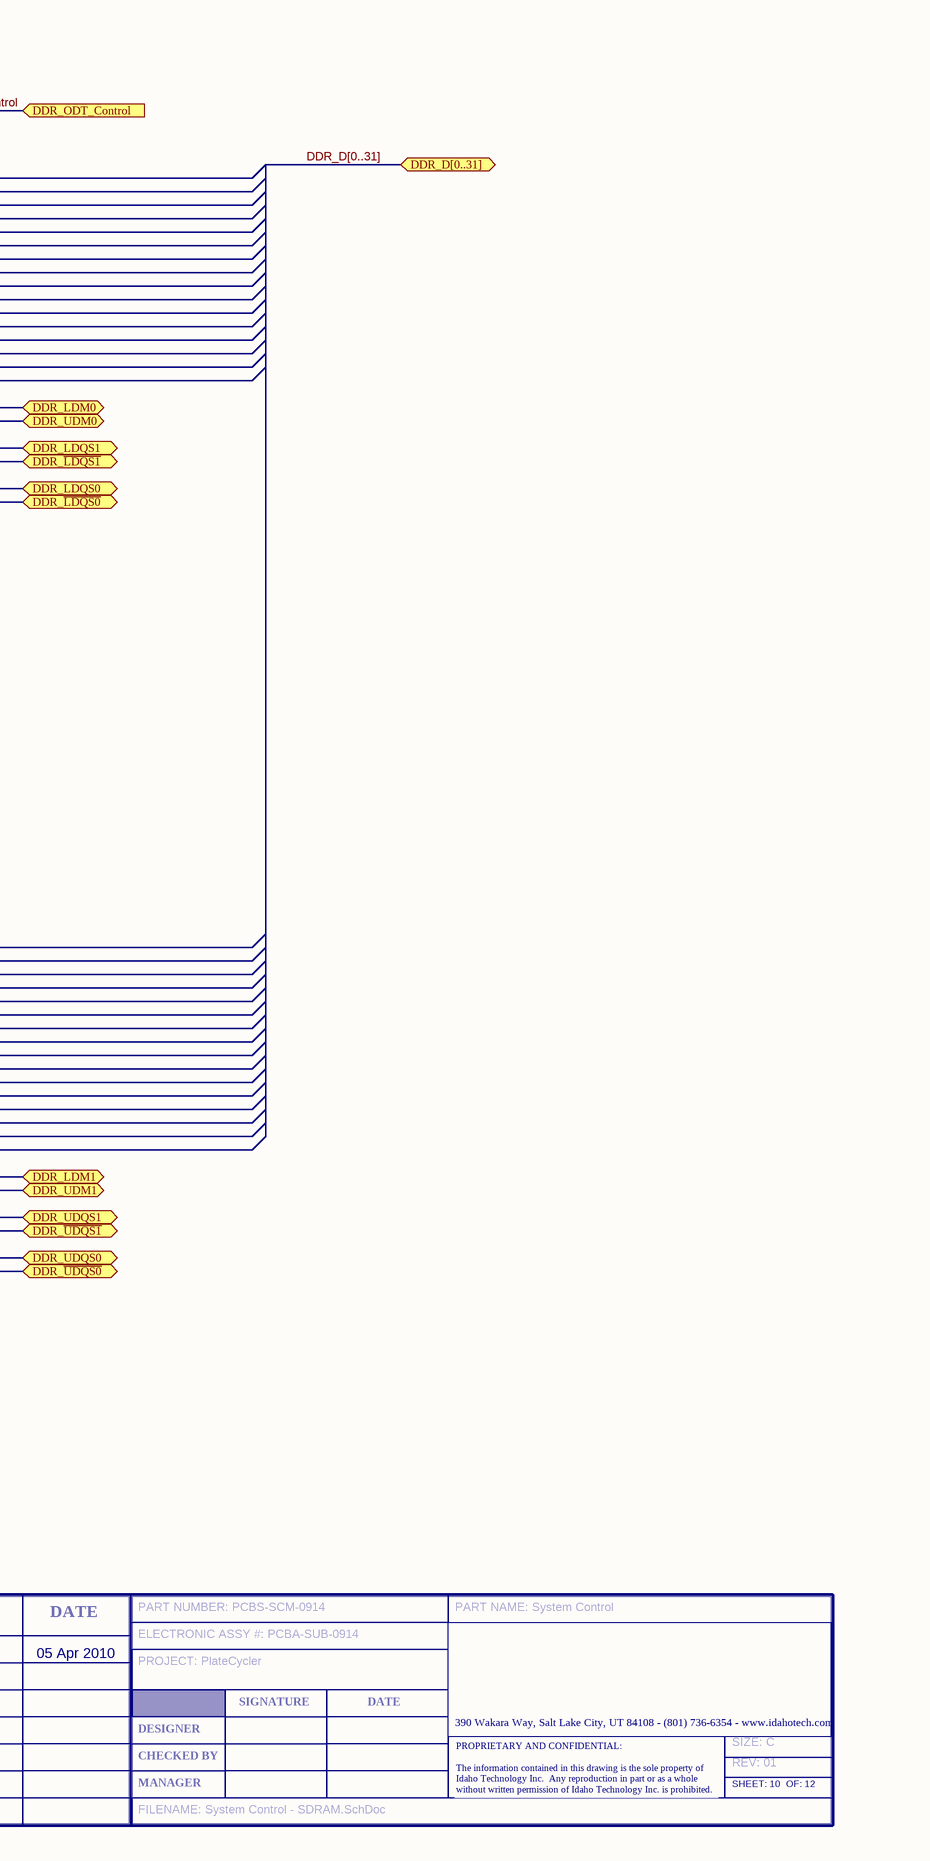
[diagram p12: System Control - SDRAM.SchDoc, right]

### Parts
(Parts that share a designator on the sheet are numbered #1, #2 ... from top to bottom, then left to right.)
C57  0.1uF 50V  [SM/C_0603]
C58  10nF 50V  [SM/C_0603]
C61  10nF 50V  [SM/C_0603]
C62  10nF 50V  [SM/C_0603]
C64  0.1uF 50V  [SM/C_0603]
C65  0.1uF 50V  [SM/C_0603]
C66  10nF 50V  [SM/C_0603]
C67  10nF 50V  [SM/C_0603]
C68  10nF 50V  [SM/C_0603]
C69  0.1uF 50V  [SM/C_0603]
C76  10nF 50V  [SM/C_0603]
C77  10nF 50V  [SM/C_0603]
C78  10nF 50V  [SM/C_0603]
C85  10nF 50V  [SM/C_0603]
C86  10nF 50V  [SM/C_0603]
C87  10nF 50V  [SM/C_0603]
C88  10nF 50V  [SM/C_0603]
C205  0.1uF 50V  [SM/C_0603]
C208  0.1uF 50V  [SM/C_0603]
C209  0.1uF 50V  [SM/C_0603]
C210  10nF 50V  [SM/C_0603]
C211  0.1uF 50V  [SM/C_0603]
C212  10nF 50V  [SM/C_0603]
C213  0.1uF 50V  [SM/C_0603]
C214  10nF 50V  [SM/C_0603]
C215  0.1uF 50V  [SM/C_0603]
C216  10nF 50V  [SM/C_0603]
C225  10nF 50V  [SM/C_0603]
C226  0.1uF 50V  [SM/C_0603]
C227  0.1uF 50V  [SM/C_0603]
C228  10nF 50V  [SM/C_0603]
C229  10nF 50V  [SM/C_0603]
C230  10nF 50V  [SM/C_0603]
C231  0.1uF 50V  [SM/C_0603]
C232  0.1uF 50V  [SM/C_0603]
C233  10nF 50V  [SM/C_0603]
C234  0.1uF 50V  [SM/C_0603]
C235  0.1uF 50V  [SM/C_0603]
C236  0.1uF 50V  [SM/C_0603]
C237  0.1uF 50V  [SM/C_0603]
C238  0.1uF 50V  [SM/C_0603]
C240  10nF 50V  [SM/C_0603]
C241  10nF 50V  [SM/C_0603]
C242  10nF 50V  [SM/C_0603]
C243  10nF 50V  [SM/C_0603]
C244  10nF 50V  [SM/C_0603]
C245  10nF 50V  [SM/C_0603]
C246  0.1uF 50V  [SM/C_0603]
C247  4.7uF  [SM/C_0603]
C251  4.7uF  [SM/C_0603]
R51  60.4  [SM/R_0402]
R52  60.4  [SM/R_0402]
R53  60.4  [SM/R_0402]
R54  60.4  [SM/R_0402]
R55  24  [SM/R_0402]
R56  60.4  [SM/R_0402]
R57  24  [SM/R_0402]
R58  60.4  [SM/R_0402]
R59  60.4  [SM/R_0402]
R60  60.4  [SM/R_0402]
R61  60.4  [SM/R_0402]
R62  60.4  [SM/R_0402]
R63  60.4  [SM/R_0402]
R64  60.4  [SM/R_0402]
R65  24  [SM/R_0402]
R66  60.4  [SM/R_0402]
R67  24  [SM/R_0402]
R68  60.4  [SM/R_0402]
R69  60.4  [SM/R_0402]
R70  60.4  [SM/R_0402]
R71  60.4  [SM/R_0402]
R72  60.4  [SM/R_0402]
R76  24  [SM/R_0402]
R77  24  [SM/R_0402]
R78  24  [SM/R_0402]
R79  24  [SM/R_0402]
R80  60.4  [SM/R_0402]
R81  60.4  [SM/R_0402]
R82  24  [SM/R_0402]
R83  24  [SM/R_0402]
R84  24  [SM/R_0402]
R85  24  [SM/R_0402]
R86  24  [SM/R_0402]
R87  24  [SM/R_0402]
R88  24  [SM/R_0402]
R89  24  [SM/R_0402]
R90  60.4  [SM/R_0402]
R91  24  [SM/R_0402]
R92  60.4  [SM/R_0402]
R93  24  [SM/R_0402]
R94  24  [SM/R_0402]
R95  24  [SM/R_0402]
R96  24  [SM/R_0402]
R97  24  [SM/R_0402]
R102  33  [SM/R_0402]
R103  33  [SM/R_0402]
R104  33  [SM/R_0402]
R105  33  [SM/R_0402]
R106  33  [SM/R_0402]
R107  33  [SM/R_0402]
R108  60.4  [SM/R_0402]
R109  33  [SM/R_0402]
R110  60.4  [SM/R_0402]
R111  60.4  [SM/R_0402]
R112  33  [SM/R_0402]
R113  33  [SM/R_0402]
R114  33  [SM/R_0402]
R115  33  [SM/R_0402]
R117  60.4  [SM/R_0402]
R118  60.4  [SM/R_0402]
R119  60.4  [SM/R_0402]
R120  60.4  [SM/R_0402]
R121  60.4  [SM/R_0402]
R122  60.4  [SM/R_0402]
R123  60.4  [SM/R_0402]
R192  60.4  [SM/R_0402]
R193  60.4  [SM/R_0402]
R194  24  [SM/R_0402]
R195  60.4  [SM/R_0402]
R196  60.4  [SM/R_0402]
R197  24  [SM/R_0402]
R198  60.4  [SM/R_0402]
R199  24  [SM/R_0402]
R200  24  [SM/R_0402]
R201  60.4  [SM/R_0402]
R202  60.4  [SM/R_0402]
R203  60.4  [SM/R_0402]
R204  24  [SM/R_0402]
R205  60.4  [SM/R_0402]
R206  60.4  [SM/R_0402]
R207  60.4  [SM/R_0402]
R208  60.4  [SM/R_0402]
R209  24  [SM/R_0402]
R210  60.4  [SM/R_0402]
R211  24  [SM/R_0402]
R212  24  [SM/R_0402]
R213  60.4  [SM/R_0402]
R221  24  [SM/R_0402]
R222  60.4  [SM/R_0402]
R223  24  [SM/R_0402]
R224  24  [SM/R_0402]
R225  60.4  [SM/R_0402]
R226  24  [SM/R_0402]
R227  24  [SM/R_0402]
R228  60.4  [SM/R_0402]
R229  60.4  [SM/R_0402]
R230  24  [SM/R_0402]
R231  24  [SM/R_0402]
R232  60.4  [SM/R_0402]
R233  24  [SM/R_0402]
R234  24  [SM/R_0402]
R235  24  [SM/R_0402]
R236  60.4  [SM/R_0402]
R237  24  [SM/R_0402]
R238  24  [SM/R_0402]
R239  60.4  [SM/R_0402]
R240  60.4  [SM/R_0402]
R241  24  [SM/R_0402]
R242  24  [SM/R_0402]
R260  33  [SM/R_0402]
R261  33  [SM/R_0402]
R262  33  [SM/R_0402]
R263  33  [SM/R_0402]
R264  33  [SM/R_0402]
R265  33  [SM/R_0402]
R266  60.4  [SM/R_0402]
R267  60.4  [SM/R_0402]
R268  60.4  [SM/R_0402]
R269  33  [SM/R_0402]
R273  60.4  [SM/R_0402]
R274  60.4  [SM/R_0402]
R275  10K 5%  [SM/R_0603]
R276  60.4  [SM/R_0402]
R277  60.4  [SM/R_0402]
R278  33  [SM/R_0402]
R279  60.4  [SM/R_0402]
R280  33  [SM/R_0402]
R281  33  [SM/R_0402]
R282  60.4  [SM/R_0402]
R284  33  [SM/R_0402]
R285  100  [SM/R_0603]
R286  33  [SM/R_0402]
R287  100  [SM/R_0603]
R289  33  [SM/R_0402]
R290  33  [SM/R_0402]
T?#10  SIZE: C  REV: 01  FILENAME: System Control - SDRAM.SchDoc  PART NUMBER: PCBS-SCM-0914  PART NAME: System Control  ELECTRONIC ASSY #: PCBA-SUB-0914  PROJECT: PlateCycler  SHEET: 10  OF: 12  (hidden comment: ITI Title Block, A Size)  (graphical)
U21  MT47H16M16BG-3:B TR  [84FBGA]
U22  MT47H16M16BG-3:B TR  [84FBGA]

### Blocks framed on the sheet
Place caps close to DDR2 IC.: C77 C88 C208-C212 C225-C228 C235 C236 C240-C242 C246 C247
Place close to FPGA: R55 R57 R76-R79 R82-R86 R112 R194 R197 R199 R200 R221 R223 R224 R226 R227 R230 R231
Place close to FPGA: R102-R107 R109 R113-R115 R260-R265 R269 R278 R280 R281 R284 R289
Place caps close to DDR2 IC.: C76 C78 C205 C213-C216 C230-C234 C237 C238 C243-C245 C251
Place close to FPGA: R108 R110 R111 R117-R123 R266-R268 R273 R274 R276 R277 R279 R282
Place close to FPGA: R65 R67 R87-R89 R91 R93-R97 R204 R209 R211 R212 R233-R235 R237 R238 R241 R242
Place close to FPGA: R286 R290
Place caps close to pull-up terminating resistors.: C57 C58 C61 C62 C64 C85 C86
Place close to FPGA: R51-R54 R56 R58-R61 R80 R81 R192 R193 R195 R196 R198 R201 R202 R222 R225 R228 R229
Place close to FPGA: R62-R64 R66 R68-R72 R90 R92 R203 R205-R208 R210 R213 R232 R236 R239 R240
Place caps close to pull-up terminating resistors.: C65-C69 C87 C229

### Ports
DDR_A[0..12] (in), DDR_BS0 (in), DDR_BS1 (in), DDR_CKE (in), DDR_CLK0 (in), DDR_CLK1 (in), DDR_D[0..31] (bidir), DDR_LDM0 (bidir), DDR_LDM1 (bidir), DDR_LDQS0 (bidir), DDR_LDQS1 (bidir), DDR_ODT_Control (in), DDR_UDM0 (bidir), DDR_UDM1 (bidir), DDR_UDQS0 (bidir), DDR_UDQS1 (bidir), DDR_~{CAS} (in), DDR_~{CLK0} (in), DDR_~{CLK1} (in), DDR_~{CS} (in), DDR_~{LDQS0} (bidir), DDR_~{LDQS1} (bidir), DDR_~{RAS} (in), DDR_~{UDQS0} (bidir), DDR_~{UDQS1} (bidir), DDR_~{WE} (in)

### Nets
+0.9V: C57.1 C58.1 C61.1 C62.1 C64.1 C65.1 C66.1 C67.1 C68.1 C69.1 C85.1 C86.1 C87.1 C229.1 R51.2 R52.2 R53.2 R54.2 R56.2 R58.2 R59.2 R60.2 R61.2 R62.2 R63.2 R64.2 R66.2 R68.2 R69.2 R70.2 R71.2 R72.2 R80.2 R81.2 R90.2 R92.2 R108.2 R110.2 R111.2 R117.2 R118.2 R119.2 R120.2 R121.2 R122.2 R123.2 R192.2 R193.2 R195.2 R196.2 R198.2 R201.2 R202.2 R203.2 R205.2 R206.2 R207.2 R208.2 R210.2 R213.2 R222.2 R225.2 R228.2 R229.2 R232.2 R236.2 R239.2 R240.2 R266.2 R267.2 R268.2 R273.2 R274.2 R276.2 R277.2 R279.2 R282.2
+1.8V: C76.1 C77.1 C78.1 C88.1 C205.1 C208.1 C209.1 C210.1 C211.1 C212.1 C213.1 C214.1 C215.1 C216.1 C225.1 C226.1 C227.1 C228.1 C230.1 C231.1 C232.1 C233.1 C234.1 C235.1 C236.1 C237.1 C238.1 C240.1 C241.1 C243.1 C244.1 C246.1 C247.1 C251.1 U21.A1(VDD) U21.A9(VDDQ) U21.C1(VDDQ) U21.C3(VDDQ) U21.C7(VDDQ) U21.C9(VDDQ) U21.E1(VDD) U21.E9(VDDQ) U21.G1(VDDQ) U21.G3(VDDQ) U21.G7(VDDQ) U21.G9(VDDQ) U21.J1(VDDL) U21.J9(VDD) U21.M9(VDD) U21.R1(VDD) U22.A1(VDD) U22.A9(VDDQ) U22.C1(VDDQ) U22.C3(VDDQ) U22.C7(VDDQ) U22.C9(VDDQ) U22.E1(VDD) U22.E9(VDDQ) U22.G1(VDDQ) U22.G3(VDDQ) U22.G7(VDDQ) U22.G9(VDDQ) U22.J1(VDDL) U22.J9(VDD) U22.M9(VDD) U22.R1(VDD)
DDR2_VREF: C242.1 C245.1 U21.J2(VREF) U22.J2(VREF)
GND: C57.2 C58.2 C61.2 C62.2 C64.2 C65.2 C66.2 C67.2 C68.2 C69.2 C76.2 C77.2 C78.2 C85.2 C86.2 C87.2 C88.2 C205.2 C208.2 C209.2 C210.2 C211.2 C212.2 C213.2 C214.2 C215.2 C216.2 C225.2 C226.2 C227.2 C228.2 C229.2 C230.2 C231.2 C232.2 C233.2 C234.2 C235.2 C236.2 C237.2 C238.2 C240.2 C241.2 C242.2 C243.2 C244.2 C245.2 C246.2 C247.2 C251.2 R275.1 U21.A3(VSS) U21.A7(VSSQ) U21.B2(VSSQ) U21.B8(VSSQ) U21.D2(VSSQ) U21.D8(VSSQ) U21.E3(VSS) U21.E7(VSSQ) U21.F2(VSSQ) U21.F8(VSSQ) U21.H2(VSSQ) U21.H8(VSSQ) U21.J3(VSS) U21.J7(VSSDL) U21.N1(VSS) U21.P9(VSS) U22.A3(VSS) U22.A7(VSSQ) U22.B2(VSSQ) U22.B8(VSSQ) U22.D2(VSSQ) U22.D8(VSSQ) U22.E3(VSS) U22.E7(VSSQ) U22.F2(VSSQ) U22.F8(VSSQ) U22.H2(VSSQ) U22.H8(VSSQ) U22.J3(VSS) U22.J7(VSSDL) U22.N1(VSS) U22.P9(VSS)
DDR_A0: R269.2
DDR_A1: R103.2
DDR_A2: R263.2
DDR_A3: R264.2
DDR_A4: R262.2
DDR_A5: R104.2
DDR_A6: R105.2
DDR_A7: R107.2
DDR_A8: R109.2
DDR_A9: R261.2
DDR_A10: R260.2
DDR_A11: R106.2
DDR_A12: R102.2
DDR_BS0: R267.1 R280.2 ; port DDR_BS0
DDR_BS1: R268.1 R281.2 ; port DDR_BS1
DDR_~{CAS}: R111.1 R115.2 ; port DDR_~{CAS}
DDR_~{CLK0}: R289.2 ; port DDR_~{CLK0}
DDR_~{CLK1}: R290.2 ; port DDR_~{CLK1}
DDR_~{CS}: R110.1 R114.2 ; port DDR_~{CS}
DDR_CKE: R265.2 ; port DDR_CKE
DDR_CLK0: R284.2 ; port DDR_CLK0
DDR_CLK1: R286.2 ; port DDR_CLK1
DDR_D0: R51.1 R76.1
DDR_D1: R202.1 R230.1
DDR_D2: R195.1 R223.1
DDR_D3: R198.1 R226.1
DDR_D4: R201.1 R231.1
DDR_D5: R192.1 R221.1
DDR_D6: R60.1 R85.1
DDR_D7: R52.1 R77.1
DDR_D8: R193.1 R224.1
DDR_D9: R56.1 R83.1
DDR_D10: R58.1 R82.1
DDR_D11: R196.1 R227.1
DDR_D12: R61.1 R86.1
DDR_D13: R54.1 R78.1
DDR_D14: R59.1 R84.1
DDR_D15: R53.1 R79.1
DDR_D16: R62.1 R87.1
DDR_D17: R72.1 R97.1
DDR_D18: R207.1 R237.1
DDR_D19: R210.1 R241.1
DDR_D20: R213.1 R242.1
DDR_D21: R203.1 R233.1
DDR_D22: R71.1 R96.1
DDR_D23: R63.1 R88.1
DDR_D24: R205.1 R235.1
DDR_D25: R68.1 R93.1
DDR_D26: R66.1 R91.1
DDR_D27: R208.1 R238.1
DDR_D28: R70.1 R94.1
DDR_D29: R206.1 R234.1
DDR_D30: R69.1 R95.1
DDR_D31: R64.1 R89.1
DDR_~{LDQS0}: R194.1 ; port DDR_~{LDQS0}
DDR_~{LDQS1}: R55.1 ; port DDR_~{LDQS1}
DDR_LDM0: R200.1 ; port DDR_LDM0
DDR_LDM1: R211.1 ; port DDR_LDM1
DDR_LDQS0: R197.1 ; port DDR_LDQS0
DDR_LDQS1: R57.1 ; port DDR_LDQS1
DDR_MEM_A0: R269.1 R282.1 U21.M8(A0) U22.M8(A0)
DDR_MEM_A1: R103.1 R117.1 U21.M3(A1) U22.M3(A1)
DDR_MEM_A2: R263.1 R277.1 U21.M7(A2) U22.M7(A2)
DDR_MEM_A3: R264.1 R279.1 U21.N2(A3) U22.N2(A3)
DDR_MEM_A4: R262.1 R276.1 U21.N8(A4) U22.N8(A4)
DDR_MEM_A5: R104.1 R119.1 U21.N3(A5) U22.N3(A5)
DDR_MEM_A6: R105.1 R120.1 U21.N7(A6) U22.N7(A6)
DDR_MEM_A7: R107.1 R122.1 U21.P2(A7) U22.P2(A7)
DDR_MEM_A8: R109.1 R123.1 U21.P8(A8) U22.P8(A8)
DDR_MEM_A9: R261.1 R274.1 U21.P3(A9) U22.P3(A9)
DDR_MEM_A10: R260.1 R273.1 U21.M2(A10) U22.M2(A10)
DDR_MEM_A11: R106.1 R121.1 U21.P7(A11) U22.P7(A11)
DDR_MEM_A12: R102.1 R118.1 U21.R2(A12) U22.R2(A12)
DDR_MEM_BS0: R280.1 U21.L2(BA0) U22.L2(BA0)
DDR_MEM_BS1: R281.1 U21.L3(BA1) U22.L3(BA1)
DDR_MEM_~{CAS}: R115.1 U21.L7(~{CAS}) U22.L7(~{CAS})
DDR_MEM_~{CLK0}: R285.2 R289.1 U21.K8(~{CK})
DDR_MEM_~{CLK1}: R287.2 R290.1 U22.K8(~{CK})
DDR_MEM_~{CS}: R114.1 U21.L8(~{CS}) U22.L8(~{CS})
DDR_MEM_CKE: R265.1 R275.2 U21.K2(CKE) U22.K2(CKE)
DDR_MEM_CLK0: R284.1 R285.1 U21.J8(CK)
DDR_MEM_CLK1: R286.1 R287.1 U22.J8(CK)
DDR_MEM_D0: R76.2 U21.G8(DQ0)
DDR_MEM_D1: R230.2 U21.G2(DQ1)
DDR_MEM_D2: R223.2 U21.H7(DQ2)
DDR_MEM_D3: R226.2 U21.H3(DQ3)
DDR_MEM_D4: R231.2 U21.H1(DQ4)
DDR_MEM_D5: R221.2 U21.H9(DQ5)
DDR_MEM_D6: R85.2 U21.F1(DQ6)
DDR_MEM_D7: R77.2 U21.F9(DQ7)
DDR_MEM_D8: R224.2 U21.C8(DQ8)
DDR_MEM_D9: R83.2 U21.C2(DQ9)
DDR_MEM_D10: R82.2 U21.D7(DQ10)
DDR_MEM_D11: R227.2 U21.D3(DQ11)
DDR_MEM_D12: R86.2 U21.D1(DQ12)
DDR_MEM_D13: R78.2 U21.D9(DQ13)
DDR_MEM_D14: R84.2 U21.B1(DQ14)
DDR_MEM_D15: R79.2 U21.B9(DQ15)
DDR_MEM_D16: R87.2 U22.G8(DQ0)
DDR_MEM_D17: R97.2 U22.G2(DQ1)
DDR_MEM_D18: R237.2 U22.H7(DQ2)
DDR_MEM_D19: R241.2 U22.H3(DQ3)
DDR_MEM_D20: R242.2 U22.H1(DQ4)
DDR_MEM_D21: R233.2 U22.H9(DQ5)
DDR_MEM_D22: R96.2 U22.F1(DQ6)
DDR_MEM_D23: R88.2 U22.F9(DQ7)
DDR_MEM_D24: R235.2 U22.C8(DQ8)
DDR_MEM_D25: R93.2 U22.C2(DQ9)
DDR_MEM_D26: R91.2 U22.D7(DQ10)
DDR_MEM_D27: R238.2 U22.D3(DQ11)
DDR_MEM_D28: R94.2 U22.D1(DQ12)
DDR_MEM_D29: R234.2 U22.D9(DQ13)
DDR_MEM_D30: R95.2 U22.B1(DQ14)
DDR_MEM_D31: R89.2 U22.B9(DQ15)
DDR_MEM_~{LDQS0}: R194.2 R222.1 U21.E8(~{LDQS}/NU)
DDR_MEM_~{LDQS1}: R55.2 R80.1 U21.A8(~{UDQS}/NU)
DDR_MEM_LDM0: R200.2 R229.1 U21.F3(LDM)
DDR_MEM_LDM1: R211.2 R239.1 U22.F3(LDM)
DDR_MEM_LDQS0: R197.2 R225.1 U21.F7(LDQS)
DDR_MEM_LDQS1: R57.2 R81.1 U21.B7(UDQS)
DDR_MEM_ODT_Control: R112.2 U21.K9(ODT) U22.K9(ODT)
DDR_MEM_~{RAS}: R113.1 U21.K7(~{RAS}) U22.K7(~{RAS})
DDR_MEM_~{UDQS0}: R204.2 R232.1 U22.E8(~{LDQS}/NU)
DDR_MEM_~{UDQS1}: R65.2 R90.1 U22.A8(~{UDQS}/NU)
DDR_MEM_UDM0: R199.2 R228.1 U21.B3(UDM)
DDR_MEM_UDM1: R212.2 R240.1 U22.B3(UDM)
DDR_MEM_UDQS0: R209.2 R236.1 U22.F7(LDQS)
DDR_MEM_UDQS1: R67.2 R92.1 U22.B7(UDQS)
DDR_MEM_~{WE}: R278.1 U21.K3(~{WE}) U22.K3(~{WE})
DDR_ODT_Control: R112.1 ; port DDR_ODT_Control
DDR_~{RAS}: R108.1 R113.2 ; port DDR_~{RAS}
DDR_~{UDQS0}: R204.1 ; port DDR_~{UDQS0}
DDR_~{UDQS1}: R65.1 ; port DDR_~{UDQS1}
DDR_UDM0: R199.1 ; port DDR_UDM0
DDR_UDM1: R212.1 ; port DDR_UDM1
DDR_UDQS0: R209.1 ; port DDR_UDQS0
DDR_UDQS1: R67.1 ; port DDR_UDQS1
DDR_~{WE}: R266.1 R278.2 ; port DDR_~{WE}

Not connected (* = marked no-connect by the designer): U21 A2(N/C)* E2(N/C)* L1(RFU)* R3(RFU)* R7(RFU)* R8(RFU)*; U22 A2(N/C)* E2(N/C)* L1(RFU)* R3(RFU)* R7(RFU)* R8(RFU)*

### Buses and harness runs
bus DDR_A[0..12] = port DDR_A[0..12]
bus DDR_D[0..31] = port DDR_D[0..31]

### Notes on the sheet
- The dev board has labeled
  these as DNP.
- 01
- Initial Release
- 05 Apr 2010
- (in symbol ITI A-size Title Block and Rev Table) REV; DESCRIPTION; DATE; SIGNATURE; 390 Wakara Way, Salt Lake City, UT 84108 - (801) 736-6354 - www.idahotech.com; DESIGNER; CHECKED BY; REVISION HISTORY; MANAGER; PROPRIETARY AND CONFIDENTIAL: / The information contained in this drawing is the sole property of / Idaho Technology Inc.  Any reproduction in part or as a whole / without written permission of Idaho Technology Inc. is prohibited.

### Library data of the parts
C57 C64 C65 C69 C205 C208 C209 C211 C213 C215 C226 C227 C231 C232 C234-C238 C246 = CAP NP_1: as C32 on sheet System Control - Parallel Flash
C58 C61 C62 C66-C68 C76-C78 C85-C88 C210 C212 C214 C216 C225 C228-C230 C233 C240-C245 = C10nF 50V X7R 0603: CAP 10000PF 50V CERM X7R 0603; Manufacturer: Panasonic; Manufacturer P/N: ECJ-1VB1H103K; Vendor P/N: PCC1784CT-ND; Vendor: Digikey
C247 C251 = CAP NP_1: as C15 on sheet System Control - Power
R51-R54 R56 R58-R64 R66 R68-R72 R80 R81 R90 R92 R108 R110 R111 R117-R123 R192 R193 R195 R196 R198 R201-R203 R205-R208 R210 R213 R222 R225 R228 R229 R232 R236 R239 R240 R266-R268 R273 R274 R276 R277 R279 R282 = R1K 5% 0603: RES 60.4 OHM 1/16W 1% 0402 SMD; Manufacturer: Panasonic; Manufacturer P/N: ERJ-2RKF60R4X; Vendor: Digikey; Vendor P/N: P60.4LCT-ND
R55 R57 R65 R67 R76-R79 R82-R89 R91 R93-R97 R194 R197 R199 R200 R204 R209 R211 R212 R221 R223 R224 R226 R227 R230 R231 R233-R235 R237 R238 R241 R242 = R1K 5% 0603: RES 24.0 OHM 1/16W 1% 0402 SMD; Manufacturer: Panasonic; Manufacturer P/N: ERJ-2RKF24R0X; Vendor: Digikey; Vendor P/N: P24.0LCT-ND
R102-R107 R109 R112-R115 R260-R265 R269 R278 R280 R281 R284 R286 R289 R290 = R1K 5% 0603: RES 33.0 OHM 1/16W 1% 0402 SMD; Manufacturer: Panasonic; Manufacturer P/N: ERJ-2RKF33R0X; Vendor: Digikey; Vendor P/N: P33.0LCT-ND
R275 = R10K 5% 0603: as R21 on sheet System Control - Parallel Flash
R285 R287 = RESISTOR_0: RES 100 OHM 1/16W .5% 0603 SMD; Manufacturer: Susumu; Manufacturer P/N: RR0816P-101-D; Vendor: Digikey; Vendor P/N: RR08P100DCT-ND
T?#10 = ITI A-size Title Block and Rev Table: ITI Title Block and Rev Table, A Size
U21 U22 = MT47H32M16BN-3:D TR: IC DDR2 SDRAM 256MB 84-FBGA; Manufacturer: Micron Technology Inc; Vendor: Digikey; Vendor P/N: 557-1046-1-ND; Manufacturer P/N: MT47H16M16BG-3:B TR

## Sheet System Control - Serial Flash.SchDoc
size B
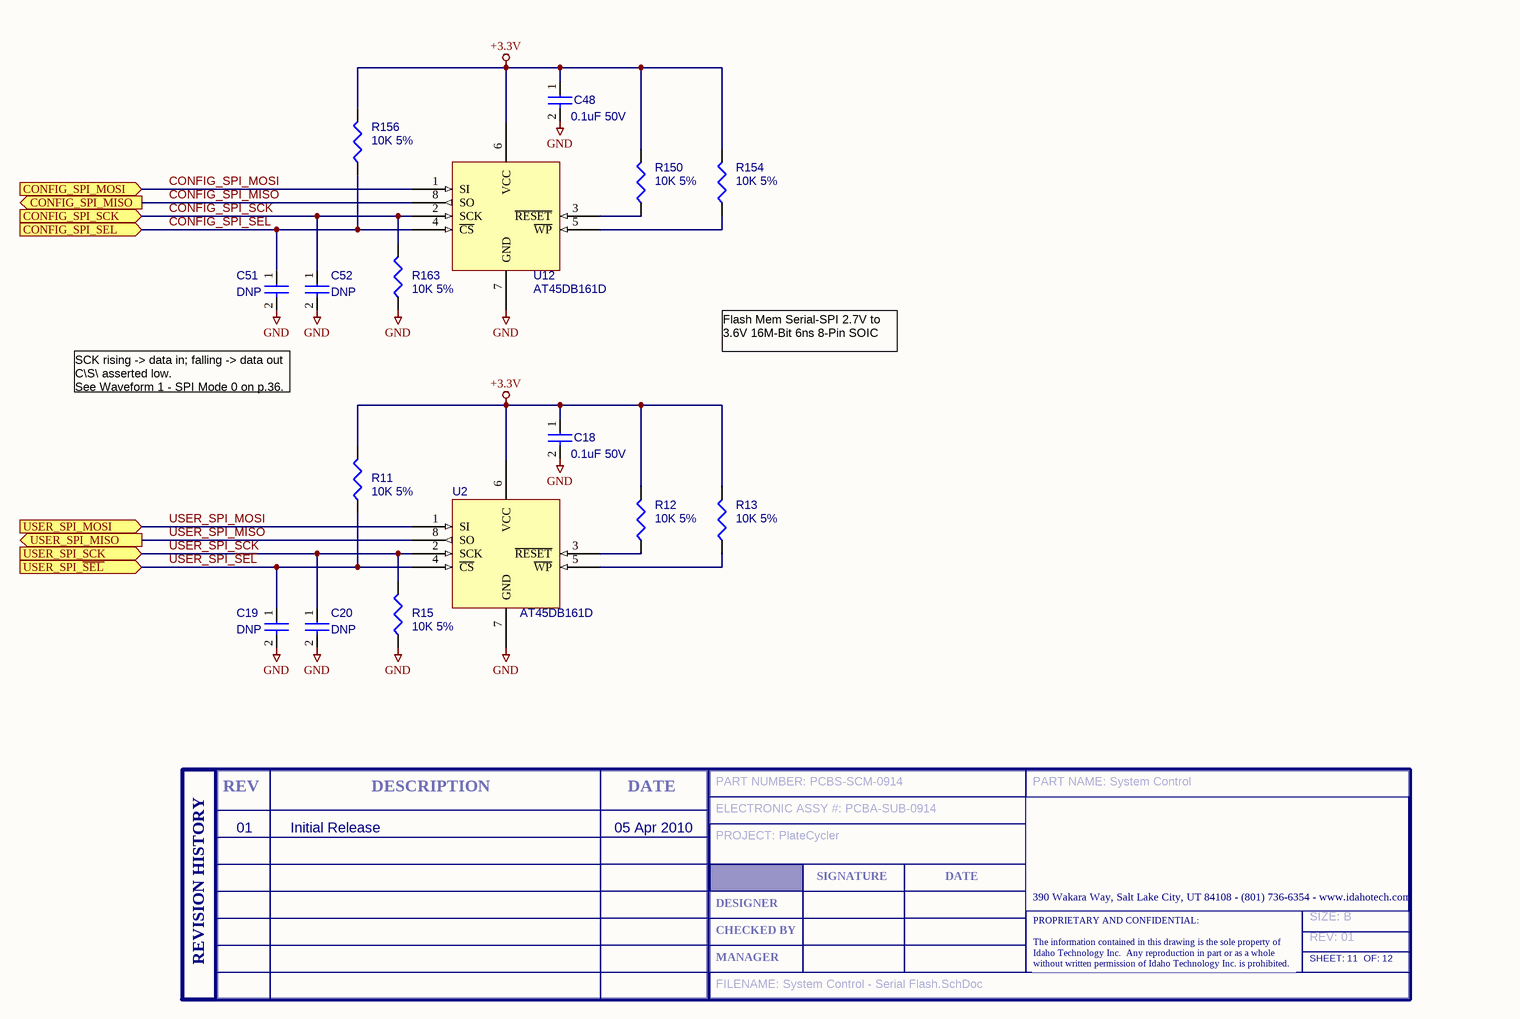
[diagram p13: System Control - Serial Flash.SchDoc]

### Parts
(Parts that share a designator on the sheet are numbered #1, #2 ... from top to bottom, then left to right.)
C18  0.1uF 50V  [SM/C_0603]
C19  DNP  [SM/C_0603]  (no BOM)
C20  DNP  [SM/C_0603]  (no BOM)
C48  0.1uF 50V  [SM/C_0603]
C51  DNP  [SM/C_0603]  (no BOM)
C52  DNP  [SM/C_0603]  (no BOM)
R11  10K 5%  [SM/R_0603]
R12  10K 5%  [SM/R_0603]
R13  10K 5%  [SM/R_0603]
R15  10K 5%  [SM/R_0603]
R150  10K 5%  [SM/R_0603]
R154  10K 5%  [SM/R_0603]
R156  10K 5%  [SM/R_0603]
R163  10K 5%  [SM/R_0603]
T?#11  SIZE: B  REV: 01  FILENAME: System Control - Serial Flash.SchDoc  PART NUMBER: PCBS-SCM-0914  PART NAME: System Control  ELECTRONIC ASSY #: PCBA-SUB-0914  PROJECT: PlateCycler  SHEET: 11  OF: 12  (hidden comment: ITI Title Block, A Size)  (graphical)
U2  AT45DB161D  [8S2_M]
U12  AT45DB161D  [8S2_M]

### Ports
CONFIG_SPI_MISO (out), CONFIG_SPI_MOSI (in), CONFIG_SPI_SCK (in), CONFIG_SPI_SEL (in), USER_SPI_MISO (out), USER_SPI_MOSI (in), USER_SPI_SCK (in), USER_SPI_~{SEL} (in)

### Nets
+3.3V: C18.1 C48.1 R11.2 R12.2 R13.2 R150.2 R154.2 R156.2 U2.6(VCC) U12.6(VCC)
GND: C18.2 C19.2 C20.2 C48.2 C51.2 C52.2 R15.1 R163.1 U2.7(GND) U12.7(GND)
CONFIG_SPI_MISO: U12.8(SO) ; port CONFIG_SPI_MISO
CONFIG_SPI_MOSI: U12.1(SI) ; port CONFIG_SPI_MOSI
CONFIG_SPI_SCK: C52.1 R163.2 U12.2(SCK) ; port CONFIG_SPI_SCK
CONFIG_SPI_SEL: C51.1 R156.1 U12.4(~{CS}) ; port CONFIG_SPI_SEL
USER_SPI_MISO: U2.8(SO) ; port USER_SPI_MISO
USER_SPI_MOSI: U2.1(SI) ; port USER_SPI_MOSI
USER_SPI_~{SEL}: C19.1 R11.1 U2.4(~{CS}) ; port USER_SPI_~{SEL}
USER_SPI_SCK: C20.1 R15.2 U2.2(SCK) ; port USER_SPI_SCK
NetR12_1: R12.1 U2.3(~{RESET})
NetR13_1: R13.1 U2.5(~{WP})
NetR150_1: R150.1 U12.3(~{RESET})
NetR154_1: R154.1 U12.5(~{WP})

### Notes on the sheet
- Flash Mem Serial-SPI 2.7V to 3.6V 16M-Bit 6ns 8-Pin SOIC
- SCK rising -> data in; falling -> data out
  C\S\ asserted low.
  See Waveform 1 - SPI Mode 0 on p.36.
- 01
- Initial Release
- 05 Apr 2010
- (in symbol ITI A-size Title Block and Rev Table) REV; DESCRIPTION; DATE; SIGNATURE; 390 Wakara Way, Salt Lake City, UT 84108 - (801) 736-6354 - www.idahotech.com; DESIGNER; CHECKED BY; REVISION HISTORY; MANAGER; PROPRIETARY AND CONFIDENTIAL: / The information contained in this drawing is the sole property of / Idaho Technology Inc.  Any reproduction in part or as a whole / without written permission of Idaho Technology Inc. is prohibited.

### Library data of the parts
C18-C20 C48 C51 C52 = CAP NP_1: as C32 on sheet System Control - Parallel Flash
R11-R13 R15 R150 R154 R156 R163 = R10K 5% 0603: as R21 on sheet System Control - Parallel Flash
T?#11 = ITI A-size Title Block and Rev Table: ITI Title Block and Rev Table, A Size
U2 U12 = AT45DB161D: Flash Mem Serial-SPI 2.7V to 3.6V 16M-Bit 6ns 8-Pin SOIC; Manufacturer P/N: AT45DB161D-SU; Manufacturer: Atmel; Vendor: Digikey; Vendor P/N: AT45DB161D-SU-ND